# EAGLE design Dashboard rev6 (EAGLE 9.6.2)

## Sheet 1 of 5: Connectors, Power Fusing
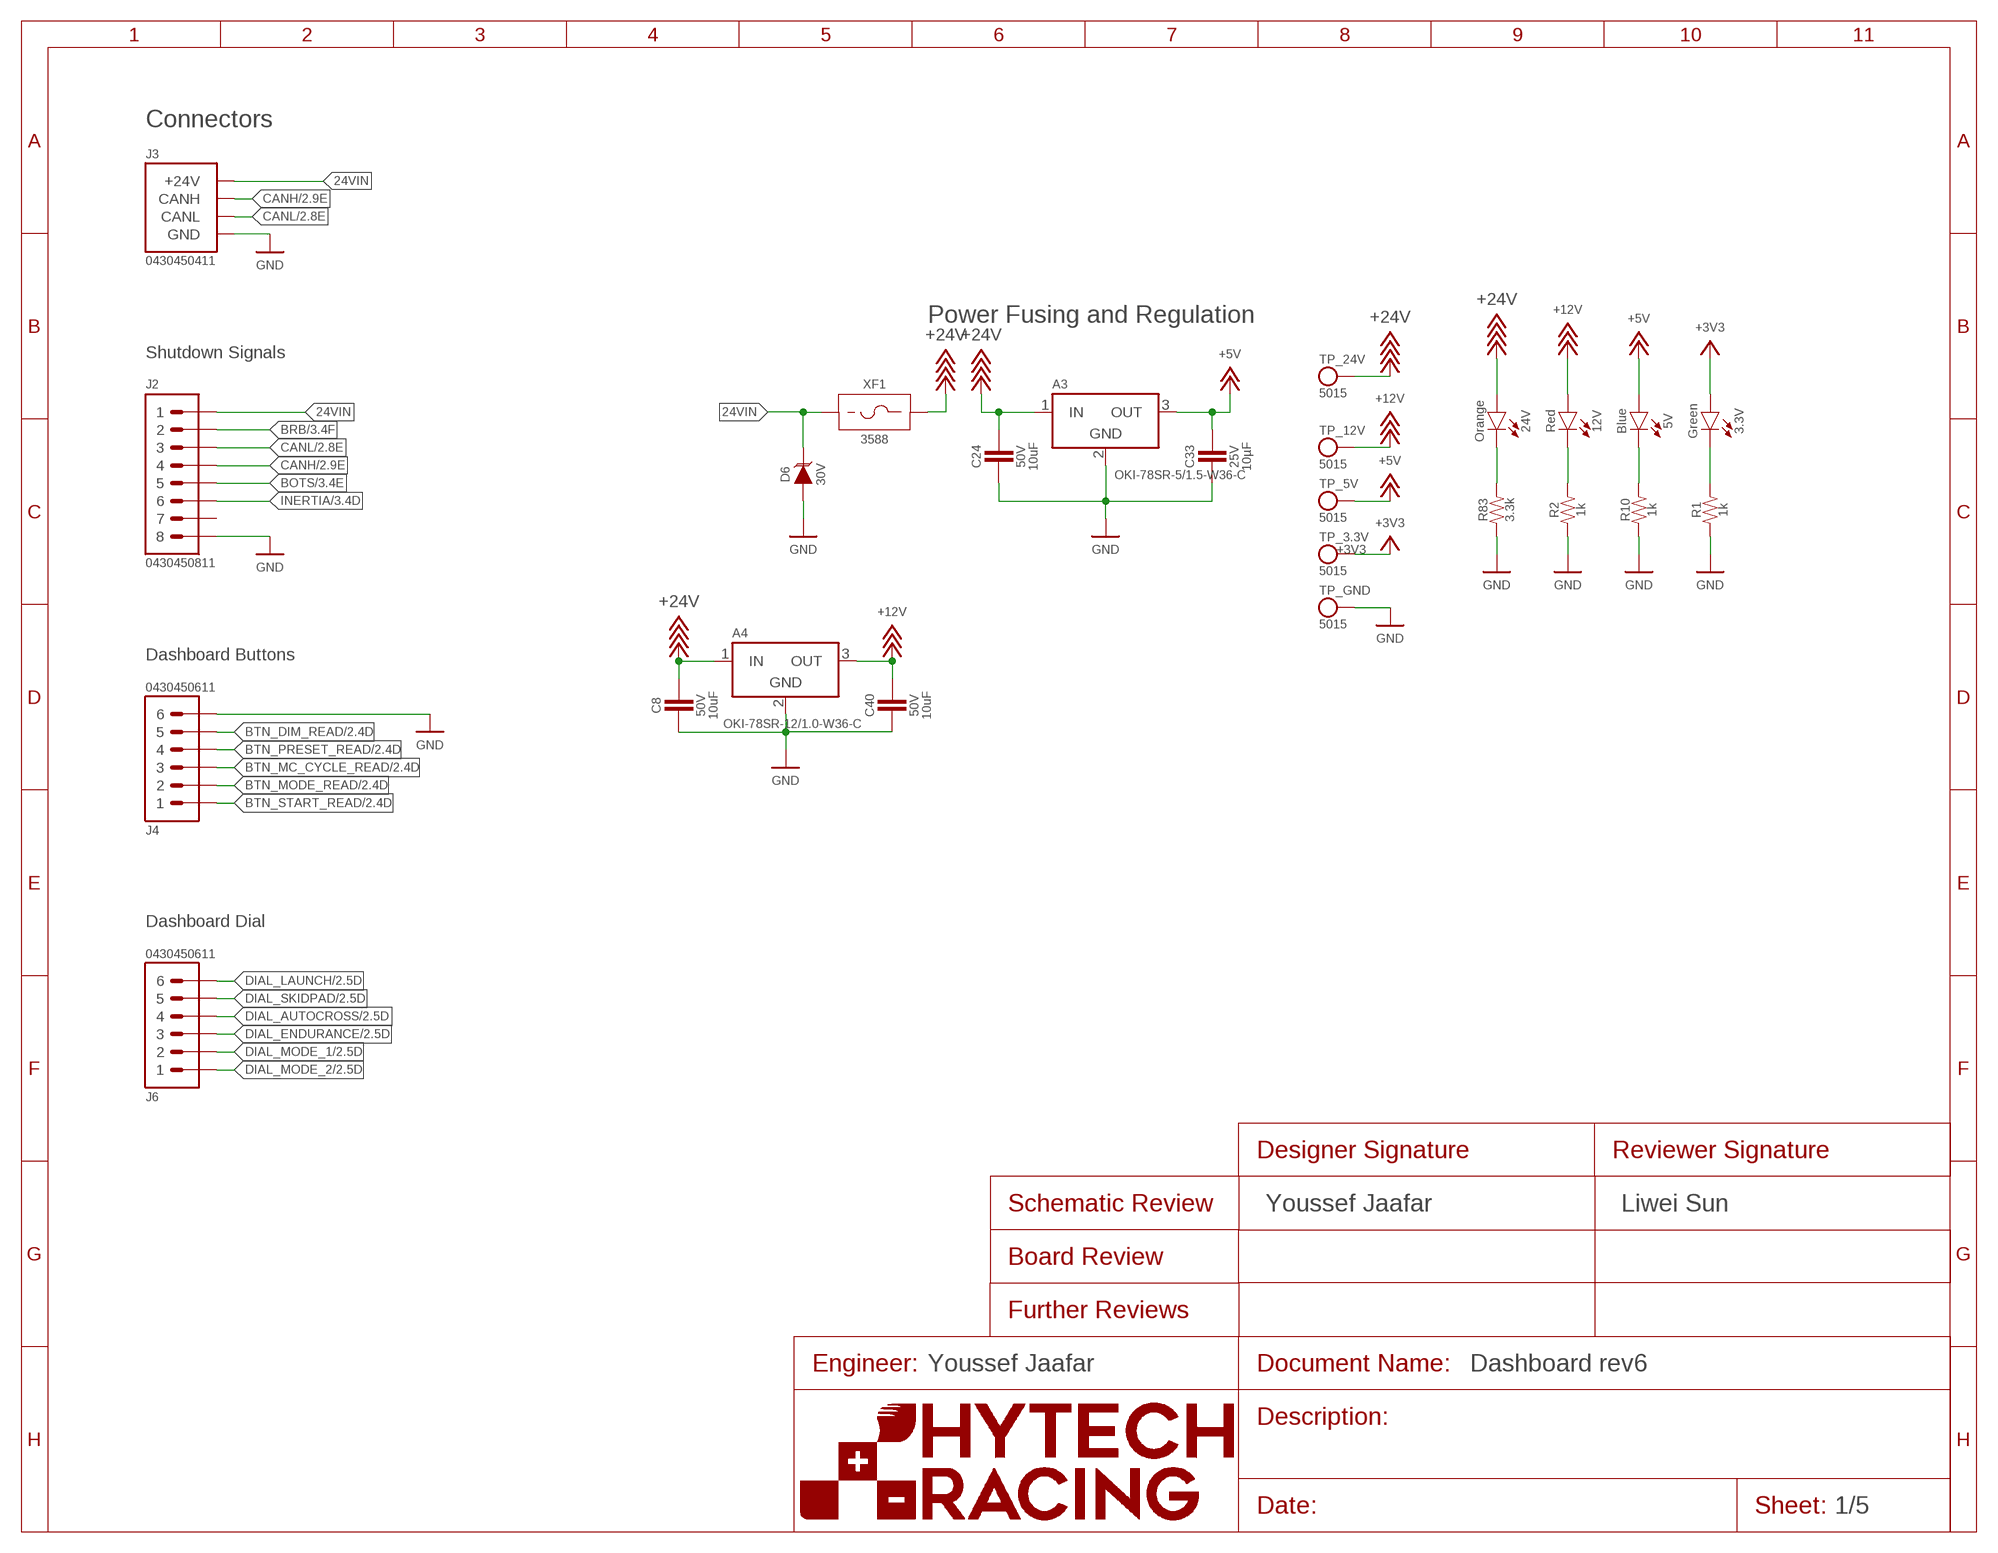
[diagram p0: schematic, sheet 1]

### Parts
3.3V  LED_0603_GREEN  [0603-LED]
5V  LED_0603_BLUE  [0603-LED]
12V  LED_0603_RED  [0603-LED]
24V  LED_0603_ORANGE  [0603-LED]
A3  VOLTAGE_REGULATOR_MODULE_OKI-78SR_5V  [OKI-78SR]
A4  VOLTAGE_REGULATOR_MODULE_OKI-78SR_12V  [OKI-78SR]
C8  CAPACITOR_0805_50V_10UF  [0805-CAP]
C24  CAPACITOR_0805_50V_10UF  [0805-CAP]
C33  CAPACITOR_0603_25V_10UF  [0603-CAP]
C40  CAPACITOR_0805_50V_10UF  [0805-CAP]
D6  TVS_DO-214AA_30V  [DO-214AA]
J2  CONNECTOR-8_μF_S_RA_  [MOLEX_MICROFIT_SMD_RIGHTANGLE_08_DUAL]
J3  CONNECTOR-CAN_μF_S_RA_  [MOLEX_MICROFIT_SMD_RIGHTANGLE_04_DUAL]
J4  CONNECTOR-6_μF_S_RA_  [MOLEX_MICROFIT_SMD_RIGHTANGLE_06_DUAL]
J6  CONNECTOR-6_μF_S_RA_  [MOLEX_MICROFIT_SMD_RIGHTANGLE_06_DUAL]
R1  RESISTOR_0603_1K  [0603-RES]
R2  RESISTOR_0603_1K  [0603-RES]
R10  RESISTOR_0603_1K  [0603-RES]
R83  RESISTOR_0603_3.3K  [0603-RES]
TP_3.3V  TEST_POINT  [5015]
TP_5V  TEST_POINT  [5015]
TP_12V  TEST_POINT  [5015]
TP_24V  TEST_POINT  [5015]
TP_GND  TEST_POINT  [5015]
XF1  FUSE_HOLDER_MINIBLADESMD  [3588]

### Nets
24VIN: D6.2(C) J2.1 J3.1(+24V) XF1.1 XF1.2
+3V3: 3.3V.2(A) TP_3.3V.1 ; also sheet 2
+5V: 5V.2(A) A3.3(OUT) C33.1 TP_5V.1 ; also sheet 2,4
+12V: 12V.2(A) A4.3(OUT) C40.1 TP_12V.1 ; also sheet 3
+24V: 24V.2(A) A3.1(IN) A4.1(IN) C8.1 C24.1 TP_24V.1 XF1.3 XF1.4
BOTS: J2.5 ; also sheet 3
BRB: J2.2 ; also sheet 3
BTN_DIM_READ: J4.5 ; also sheet 2
BTN_MC_CYCLE_READ: J4.3 ; also sheet 2
BTN_MODE_READ: J4.2 ; also sheet 2
BTN_PRESET_READ: J4.4 ; also sheet 2
BTN_START_READ: J4.1 ; also sheet 2
CANH: J2.4 J3.4(CANH) ; also sheet 2
CANL: J2.3 J3.3(CANL) ; also sheet 2
DIAL_AUTOCROSS: J6.4 ; also sheet 2
DIAL_ENDURANCE: J6.3 ; also sheet 2
DIAL_LAUNCH: J6.6 ; also sheet 2
DIAL_MODE_1: J6.2 ; also sheet 2
DIAL_MODE_2: J6.1 ; also sheet 2
DIAL_SKIDPAD: J6.5 ; also sheet 2
GND: A3.2(GND) A4.2(GND) C8.2 C24.2 C33.2 C40.2 D6.1(A) J2.8 J3.2(GND) J4.6 R1.1 R2.1 R10.1 R83.1 TP_GND.1 ; also sheet 2,3,4
INERTIA: J2.6 ; also sheet 3
N$31: 3.3V.1(C) R1.2
N$32: 5V.1(C) R10.2
N$33: 12V.1(C) R2.2
N$38: 24V.1(C) R83.2
Unconnected: J2.7

### Notes on the sheet
- Connectors
- Power Fusing and Regulation
- Shutdown Signals
- Dashboard Buttons
- Dashboard Dial
- Youssef Jaafar | Liwei Sun
- Youssef Jaafar

## Sheet 2 of 5: Teensy, CAN, IO-Expander, 7-Segment
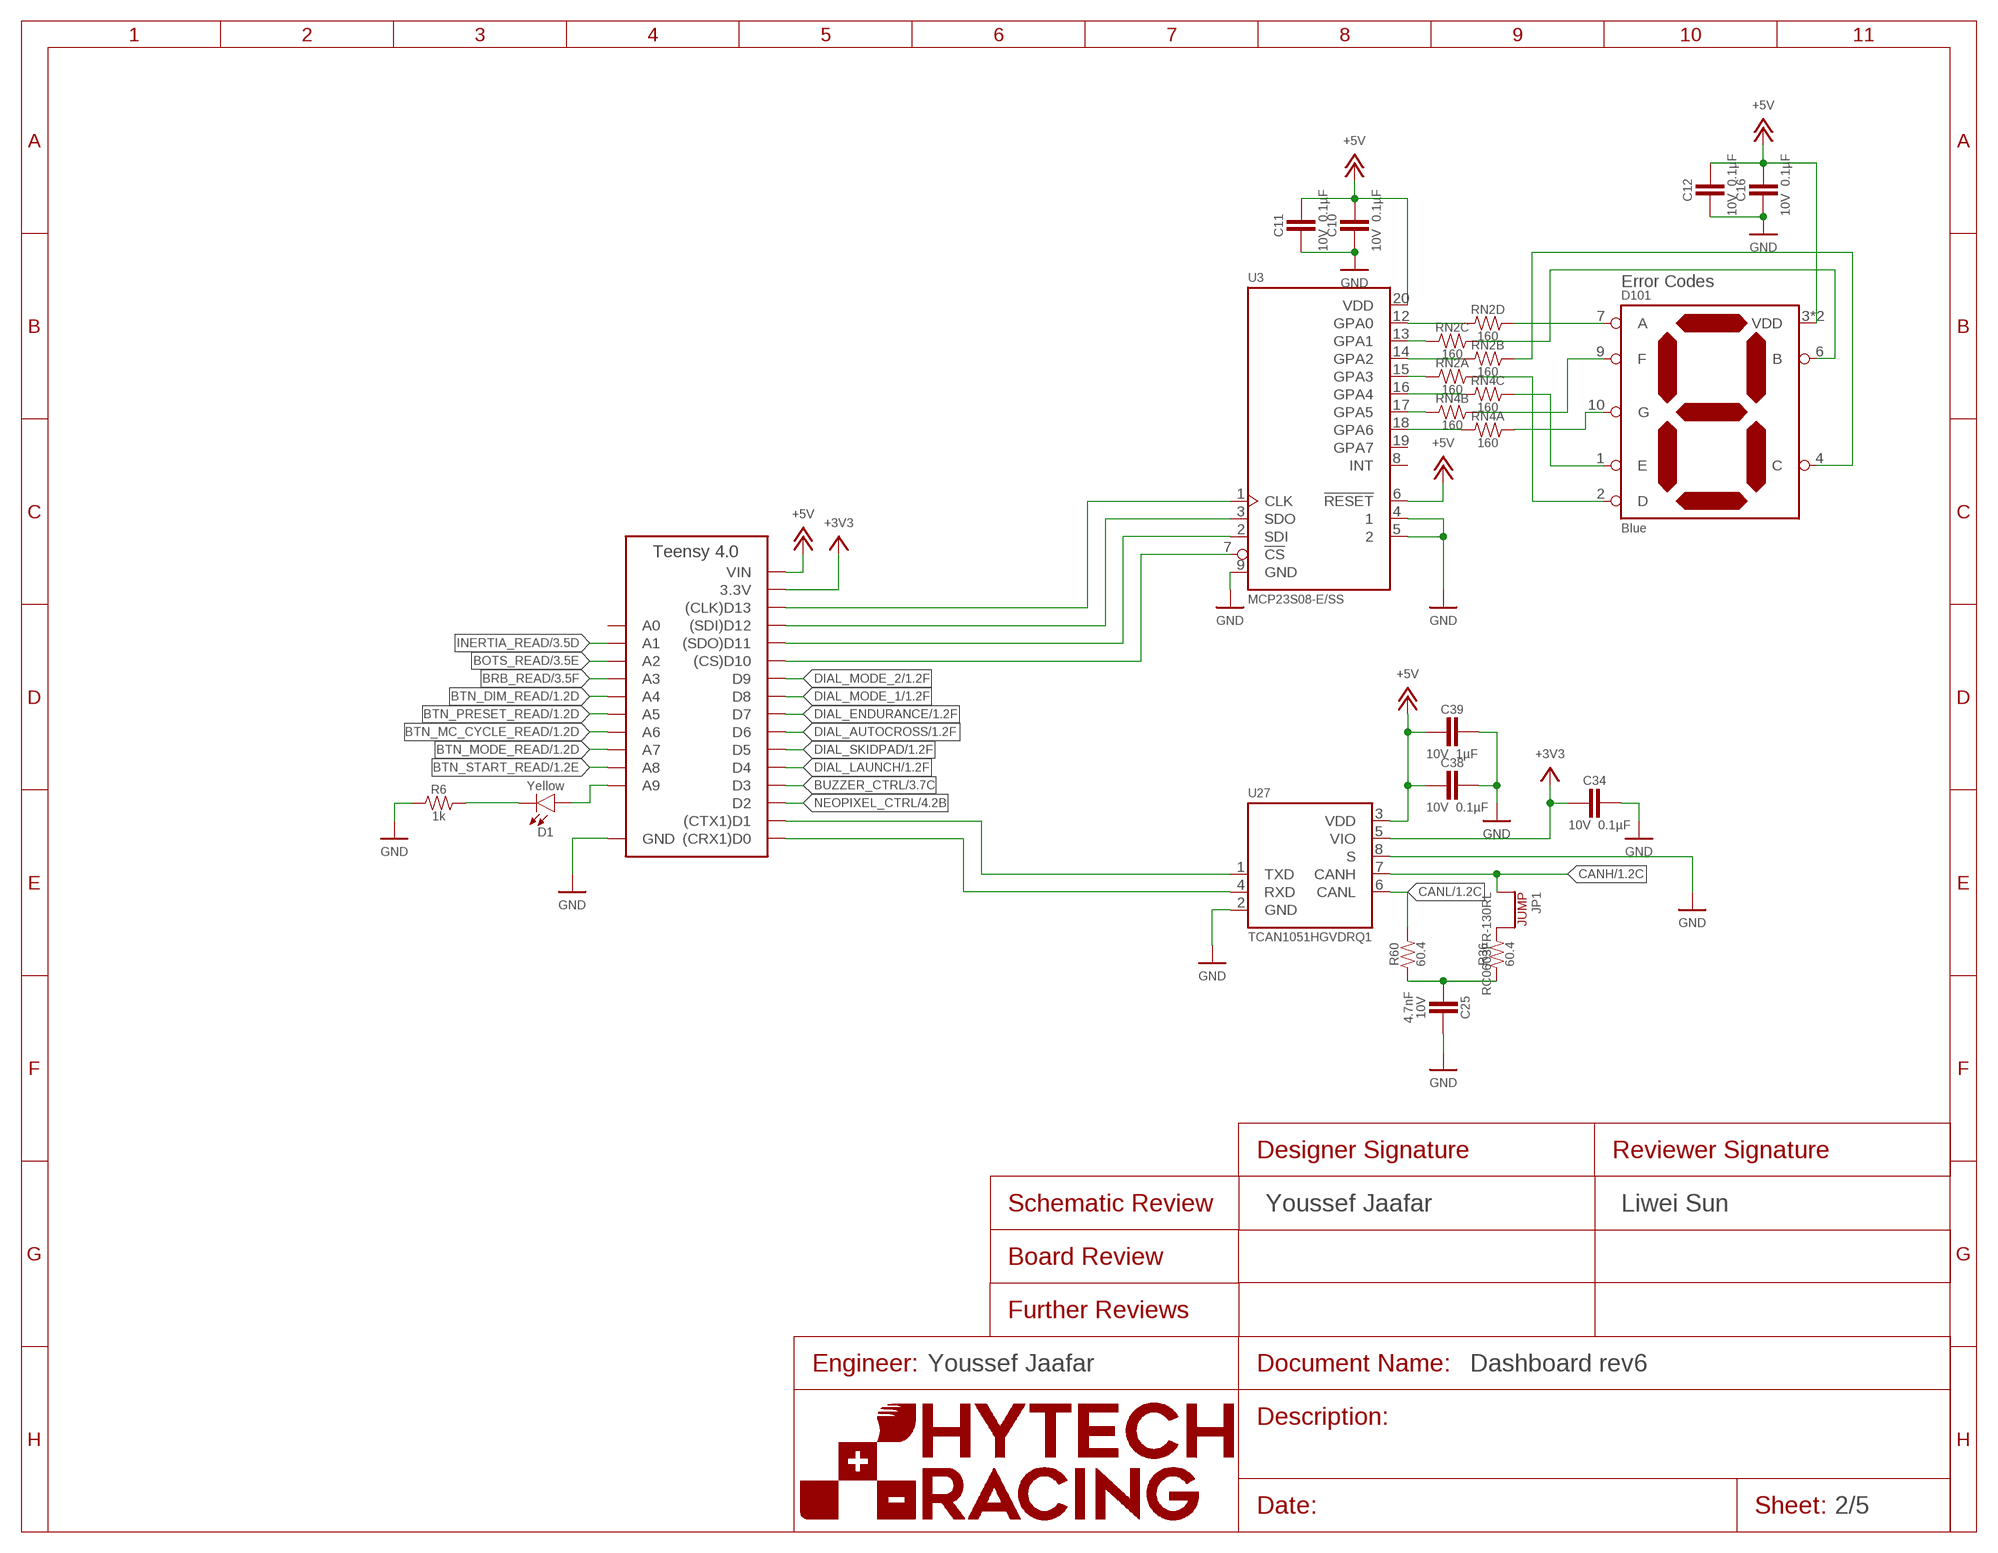
[diagram p1: schematic, sheet 2]

### Parts
A2  TEENSY_4.0SM  [TEENSY_SHORT_SSM]
C10  CAPACITOR_0603_10V_0.1UF  [0603-CAP]
C11  CAPACITOR_0603_10V_0.1UF  [0603-CAP]
C12  CAPACITOR_0603_10V_0.1UF  [0603-CAP]
C16  CAPACITOR_0603_10V_0.1UF  [0603-CAP]
C25  CAPACITOR_0603_10V_4.7NF  [0603-CAP]
C34  CAPACITOR_0603_10V_0.1UF  [0603-CAP]
C38  CAPACITOR_0603_10V_0.1UF  [0603-CAP]
C39  CAPACITOR_0603_10V_1UF  [0603-CAP]
D1  LED_0603_YELLOW  [0603-LED]
D101  LED_7_SEGMENT_BLUE_DSM7TA  [DSM7T]
JP1  JUMPER_0603_  [0603-RES]
R6  RESISTOR_0603_1K  [0603-RES]
R36  RESISTOR_0603_60.4  [0603-RES]
R60  RESISTOR_0603_60.4  [0603-RES]
RN2  RESISTOR_NETWORK_4_160  [1206-RES-ARRAY]
RN4  RESISTOR_NETWORK_4_160  [1206-RES-ARRAY]
U3  MCP23S08  [SSOP-20]
U27  TCAN1051HQV-Q1  [SOIC-08(NARROW,0.15")]

### Nets
+3V3: A2.3.3V C34.2 U27.5(VIO) ; also sheet 1
+5V: A2.VIN C10.1 C11.1 C12.1 C16.1 C38.2 C39.2 D101.3(VDD) D101.8(VDD) U3.6(!RESET) U3.20(VDD) U27.3(VDD) ; also sheet 1,4
A: D101.7(A) RN2.5
A2: RN2.4 U3.12(GPA0)
B: D101.6(B) RN2.6
B2: RN2.3 U3.13(GPA1)
BOTS_READ: A2.D16(A2) ; also sheet 3
BRB_READ: A2.D17(A3) ; also sheet 3
BTN_DIM_READ: A2.D18(A4) ; also sheet 1
BTN_MC_CYCLE_READ: A2.D20(A6) ; also sheet 1
BTN_MODE_READ: A2.D21(A7) ; also sheet 1
BTN_PRESET_READ: A2.D19(A5) ; also sheet 1
BTN_START_READ: A2.D22(A8) ; also sheet 1
BUZZER_CTRL: A2.D3 ; also sheet 3
C: D101.4(C) RN2.7
C2: RN2.2 U3.14(GPA2)
CANH: JP1.1 U27.7(CANH) ; also sheet 1
CANL: R60.2 U27.6(CANL) ; also sheet 1
CIPO: A2.D12((SDI)D12) U3.3(SDO)
CLK: A2.D13((CLK)D13) U3.1(CLK)
COPI: A2.D11((SDO)D11) U3.2(SDI)
CRX: A2.D0((CRX1)D0) U27.4(RXD)
CS_CAN: A2.D10((CS)D10) U3.7(!CS)
CTX: A2.D1((CTX1)D1) U27.1(TXD)
D: D101.2(D) RN2.8
D2: RN2.1 U3.15(GPA3)
DIAL_AUTOCROSS: A2.D6 ; also sheet 1
DIAL_ENDURANCE: A2.D7 ; also sheet 1
DIAL_LAUNCH: A2.D4 ; also sheet 1
DIAL_MODE_1: A2.D8 ; also sheet 1
DIAL_MODE_2: A2.D9 ; also sheet 1
DIAL_SKIDPAD: A2.D5 ; also sheet 1
E: D101.1(E) RN4.6
E2: RN4.3 U3.16(GPA4)
F: D101.9(F) RN4.7
F2: RN4.2 U3.17(GPA5)
G: D101.10(G) RN4.8
G2: RN4.1 U3.18(GPA6)
GND: A2.AGND/GND(GND) A2.GND C10.2 C11.2 C12.2 C16.2 C25.1 C34.1 C38.1 C39.1 R6.1 U3.4 U3.5 U3.9(GND) U27.2(GND) U27.8(S) ; also sheet 1,3,4
INERTIA_READ: A2.D15(A1) ; also sheet 3
N$3: D1.1(C) R6.2
N$10: JP1.2 R36.2
N$21: C25.2 R36.1 R60.1
NEOPIXEL_CTRL: A2.D2 ; also sheet 4
TEENSY_ON: A2.D23(A9) D1.2(A)
Unconnected: A2.D14(A0) RN4.4 RN4.5 U3.8(INT) U3.19(GPA7)

### Notes on the sheet
- Error Codes
- Youssef Jaafar | Liwei Sun
- Youssef Jaafar

## Sheet 3 of 5: Shutdown Read, Buzzer Control
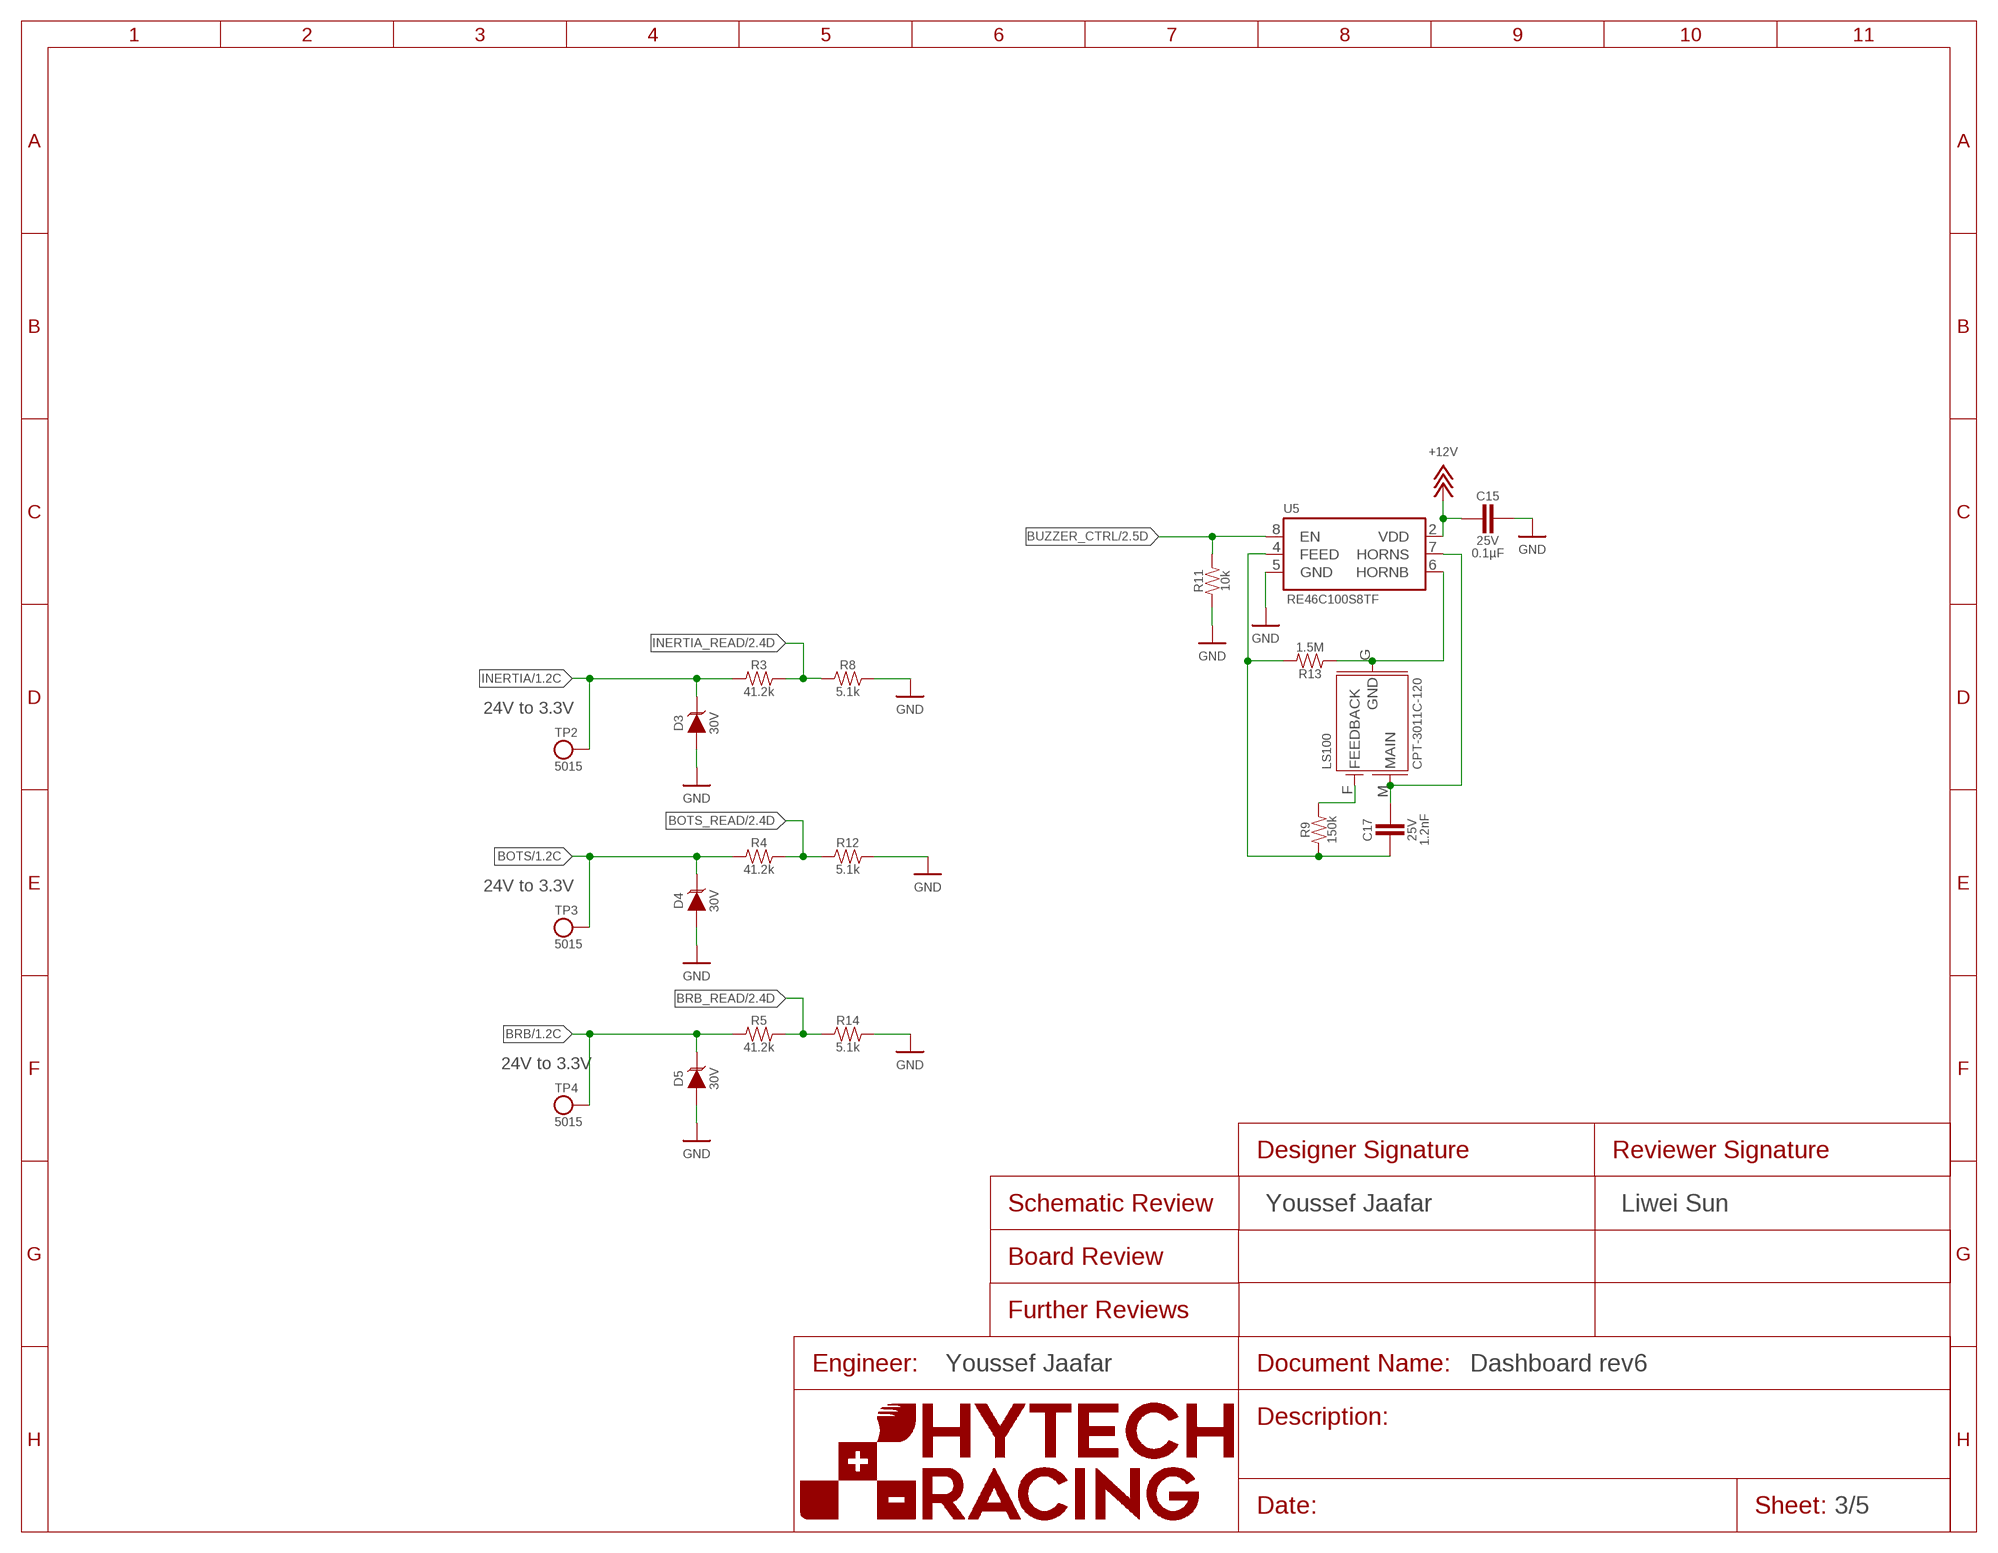
[diagram p2: schematic, sheet 3]

### Parts
C15  CAPACITOR_0603_25V_0.1UF  [0603-CAP]
C17  CAPACITOR_0603_25V_1.2NF  [0603-CAP]
D3  TVS_DO-214AA_30V  [DO-214AA]
D4  TVS_DO-214AA_30V  [DO-214AA]
D5  TVS_DO-214AA_30V  [DO-214AA]
LS100  BUZZER_3_PIN_CPT-3011C-120  [CPT-3011C-120]
R3  RESISTOR_0603_41.2K  [0603-RES]
R4  RESISTOR_0603_41.2K  [0603-RES]
R5  RESISTOR_0603_41.2K  [0603-RES]
R8  RESISTOR_0603_5.1K  [0603-RES]
R9  RESISTOR_0603_150K  [0603-RES]
R11  RESISTOR_0603_10K  [0603-RES]
R12  RESISTOR_0603_5.1K  [0603-RES]
R13  RESISTOR_0603_1.5M  [0603-RES]
R14  RESISTOR_0603_5.1K  [0603-RES]
TP2  TEST_POINT  [5015]
TP3  TEST_POINT  [5015]
TP4  TEST_POINT  [5015]
U5  RE46C100  [SOIC-08(NARROW,0.15")]

### Nets
+12V: C15.2 U5.2(VDD) ; also sheet 1
BOTS: D4.2(C) R4.1 TP3.1 ; also sheet 1
BOTS_READ: R4.2 R12.1 ; also sheet 2
BRB: D5.2(C) R5.1 TP4.1 ; also sheet 1
BRB_READ: R5.2 R14.1 ; also sheet 2
BUZZER_CTRL: R11.2 U5.8(EN) ; also sheet 2
FEED: C17.2 R9.1 R13.2 U5.4(FEED)
GND: C15.1 D3.1(A) D4.1(A) D5.1(A) R8.2 R11.1 R12.2 R14.2 U5.5(GND) ; also sheet 1,2,4
HORNB: LS100.G(GND) R13.1 U5.6(HORNB)
HORNS: C17.1 LS100.M(MAIN) U5.7(HORNS)
INERTIA: D3.2(C) R3.1 TP2.1 ; also sheet 1
INERTIA_READ: R3.2 R8.1 ; also sheet 2
N$54: LS100.F(FEEDBACK) R9.2

### Notes on the sheet
- 24V to 3.3V
- 24V to 3.3V
- 24V to 3.3V
- Youssef Jaafar | Liwei Sun
- Youssef Jaafar

## Sheet 4 of 5: Neopixels
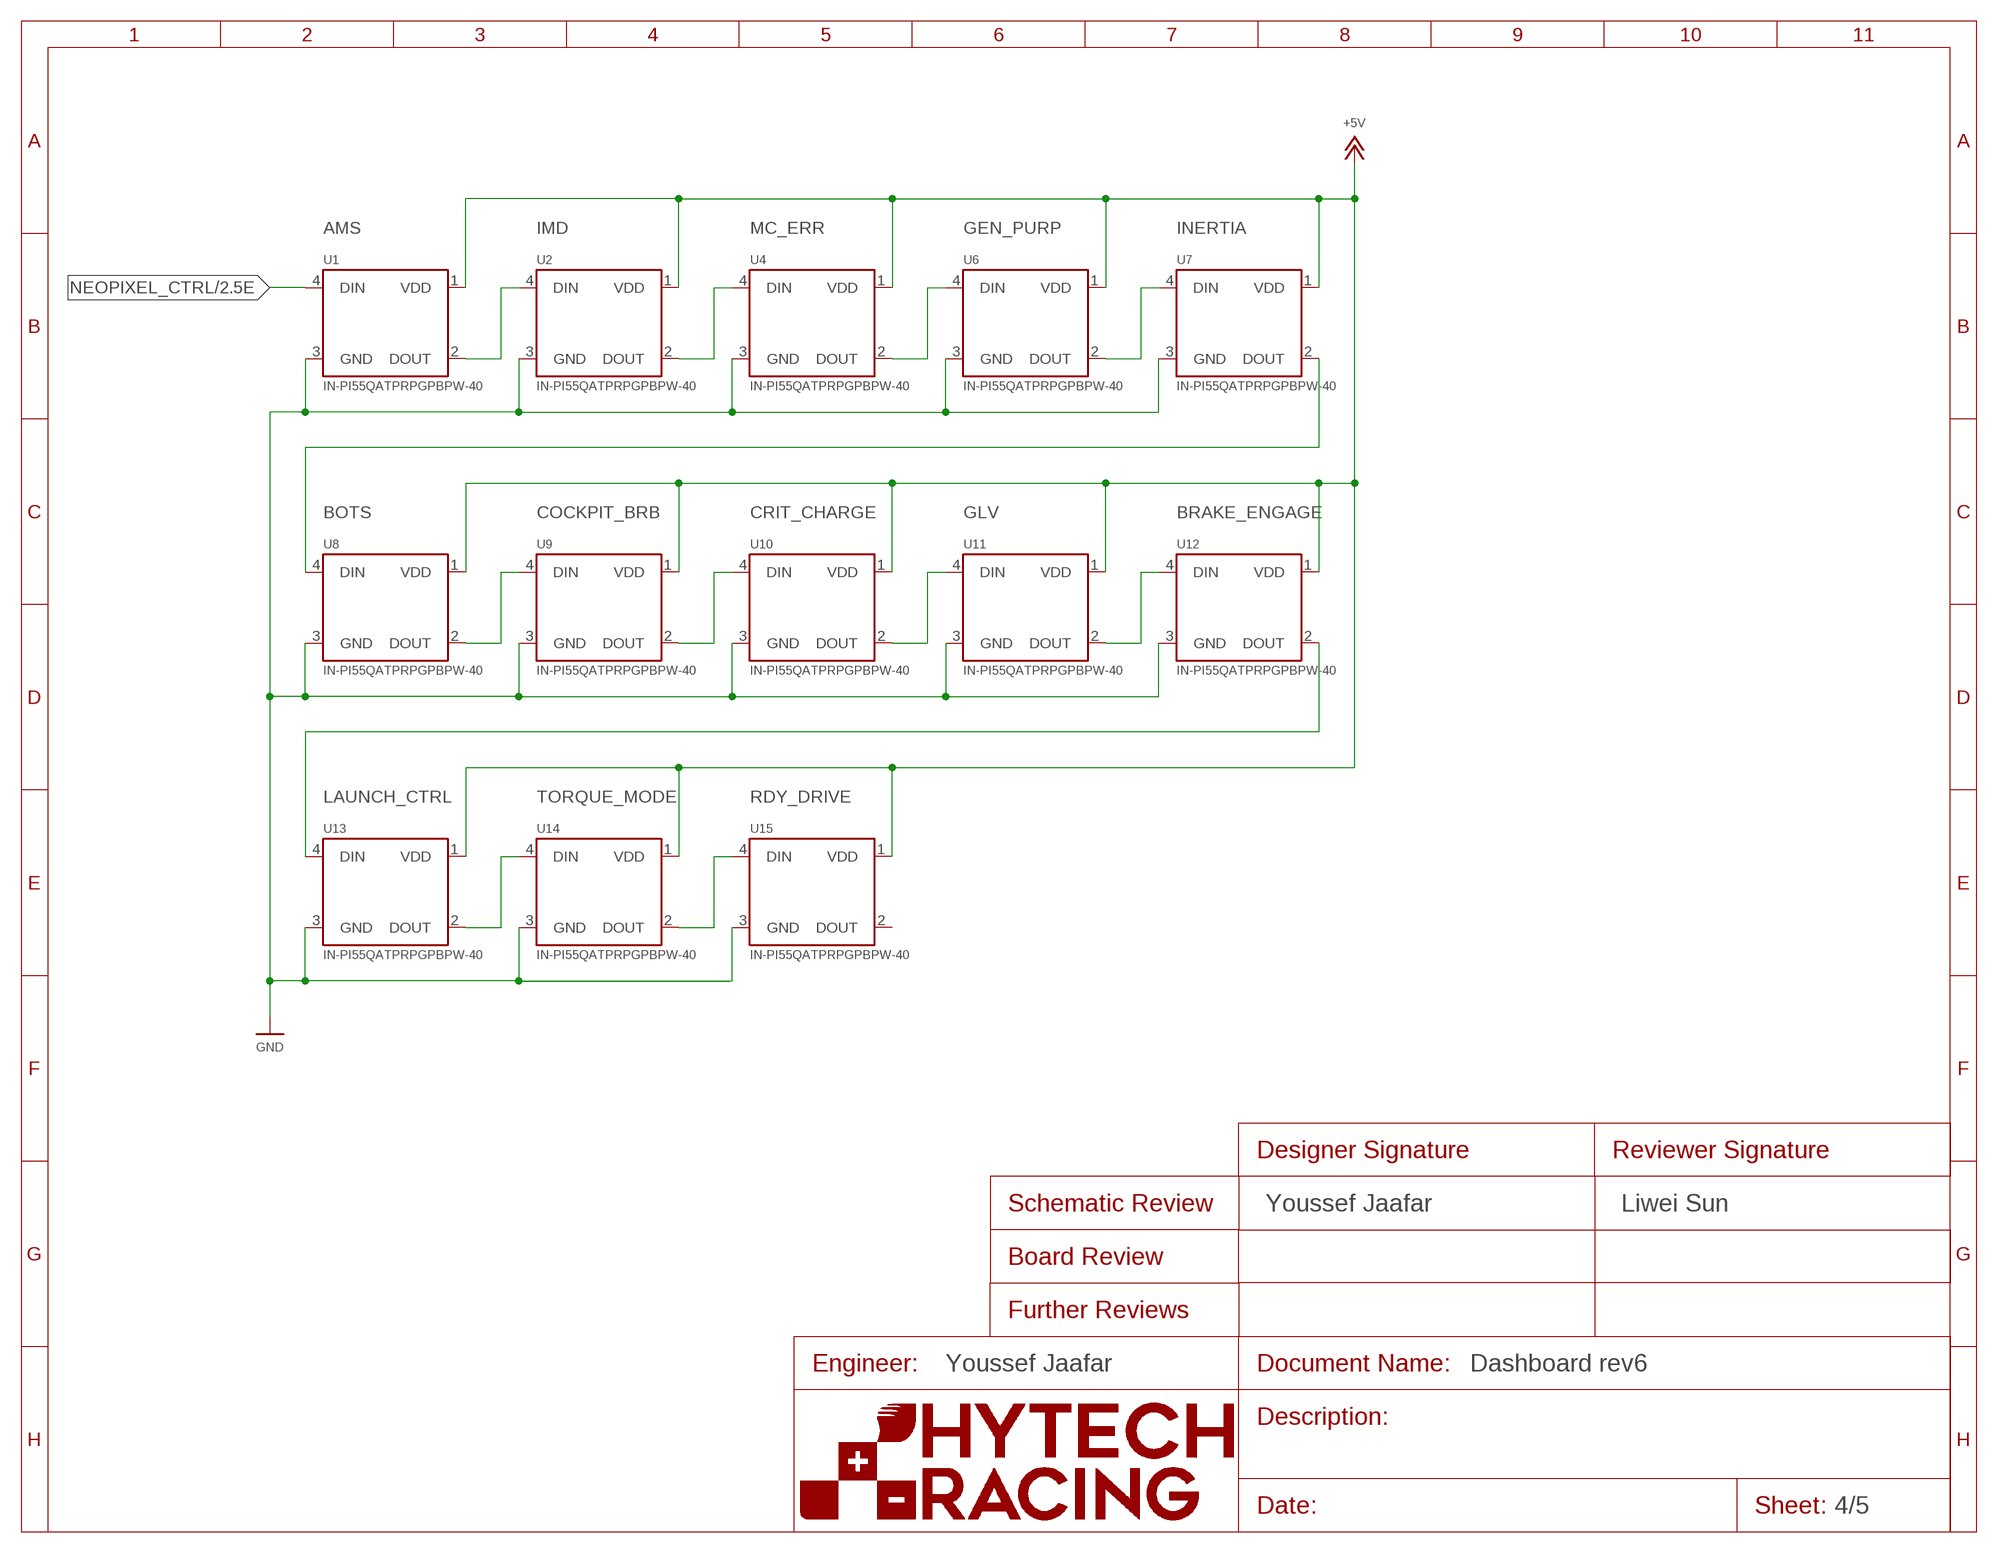
[diagram p3: schematic, sheet 4]

### Parts
U1  NEOPIXEL_IN-PI55QATPRPGPBPW-40  [NEOPIXEL]
U2  NEOPIXEL_IN-PI55QATPRPGPBPW-40  [NEOPIXEL]
U4  NEOPIXEL_IN-PI55QATPRPGPBPW-40  [NEOPIXEL]
U6  NEOPIXEL_IN-PI55QATPRPGPBPW-40  [NEOPIXEL]
U7  NEOPIXEL_IN-PI55QATPRPGPBPW-40  [NEOPIXEL]
U8  NEOPIXEL_IN-PI55QATPRPGPBPW-40  [NEOPIXEL]
U9  NEOPIXEL_IN-PI55QATPRPGPBPW-40  [NEOPIXEL]
U10  NEOPIXEL_IN-PI55QATPRPGPBPW-40  [NEOPIXEL]
U11  NEOPIXEL_IN-PI55QATPRPGPBPW-40  [NEOPIXEL]
U12  NEOPIXEL_IN-PI55QATPRPGPBPW-40  [NEOPIXEL]
U13  NEOPIXEL_IN-PI55QATPRPGPBPW-40  [NEOPIXEL]
U14  NEOPIXEL_IN-PI55QATPRPGPBPW-40  [NEOPIXEL]
U15  NEOPIXEL_IN-PI55QATPRPGPBPW-40  [NEOPIXEL]

### Nets
+5V: U1.1(VDD) U2.1(VDD) U4.1(VDD) U6.1(VDD) U7.1(VDD) U8.1(VDD) U9.1(VDD) U10.1(VDD) U11.1(VDD) U12.1(VDD) U13.1(VDD) U14.1(VDD) U15.1(VDD) ; also sheet 1,2
GND: U1.3(GND) U2.3(GND) U4.3(GND) U6.3(GND) U7.3(GND) U8.3(GND) U9.3(GND) U10.3(GND) U11.3(GND) U12.3(GND) U13.3(GND) U14.3(GND) U15.3(GND) ; also sheet 1,2,3
N$1: U10.2(DOUT) U11.4(DIN)
N$4: U8.2(DOUT) U9.4(DIN)
N$5: U1.2(DOUT) U2.4(DIN)
N$6: U2.2(DOUT) U4.4(DIN)
N$7: U4.2(DOUT) U6.4(DIN)
N$8: U6.2(DOUT) U7.4(DIN)
N$9: U11.2(DOUT) U12.4(DIN)
N$12: U14.2(DOUT) U15.4(DIN)
N$20: U13.2(DOUT) U14.4(DIN)
N$23: U9.2(DOUT) U10.4(DIN)
N$26: U7.2(DOUT) U8.4(DIN)
N$27: U12.2(DOUT) U13.4(DIN)
NEOPIXEL_CTRL: U1.4(DIN) ; also sheet 2
Unconnected: U15.2(DOUT)

### Notes on the sheet
- AMS | IMD | MC_ERR | GEN_PURP | INERTIA
- BOTS | COCKPIT_BRB | CRIT_CHARGE | GLV | BRAKE_ENGAGE
- LAUNCH_CTRL | TORQUE_MODE | RDY_DRIVE
- Youssef Jaafar | Liwei Sun
- Youssef Jaafar

## Sheet 5 of 5: Ordering Components
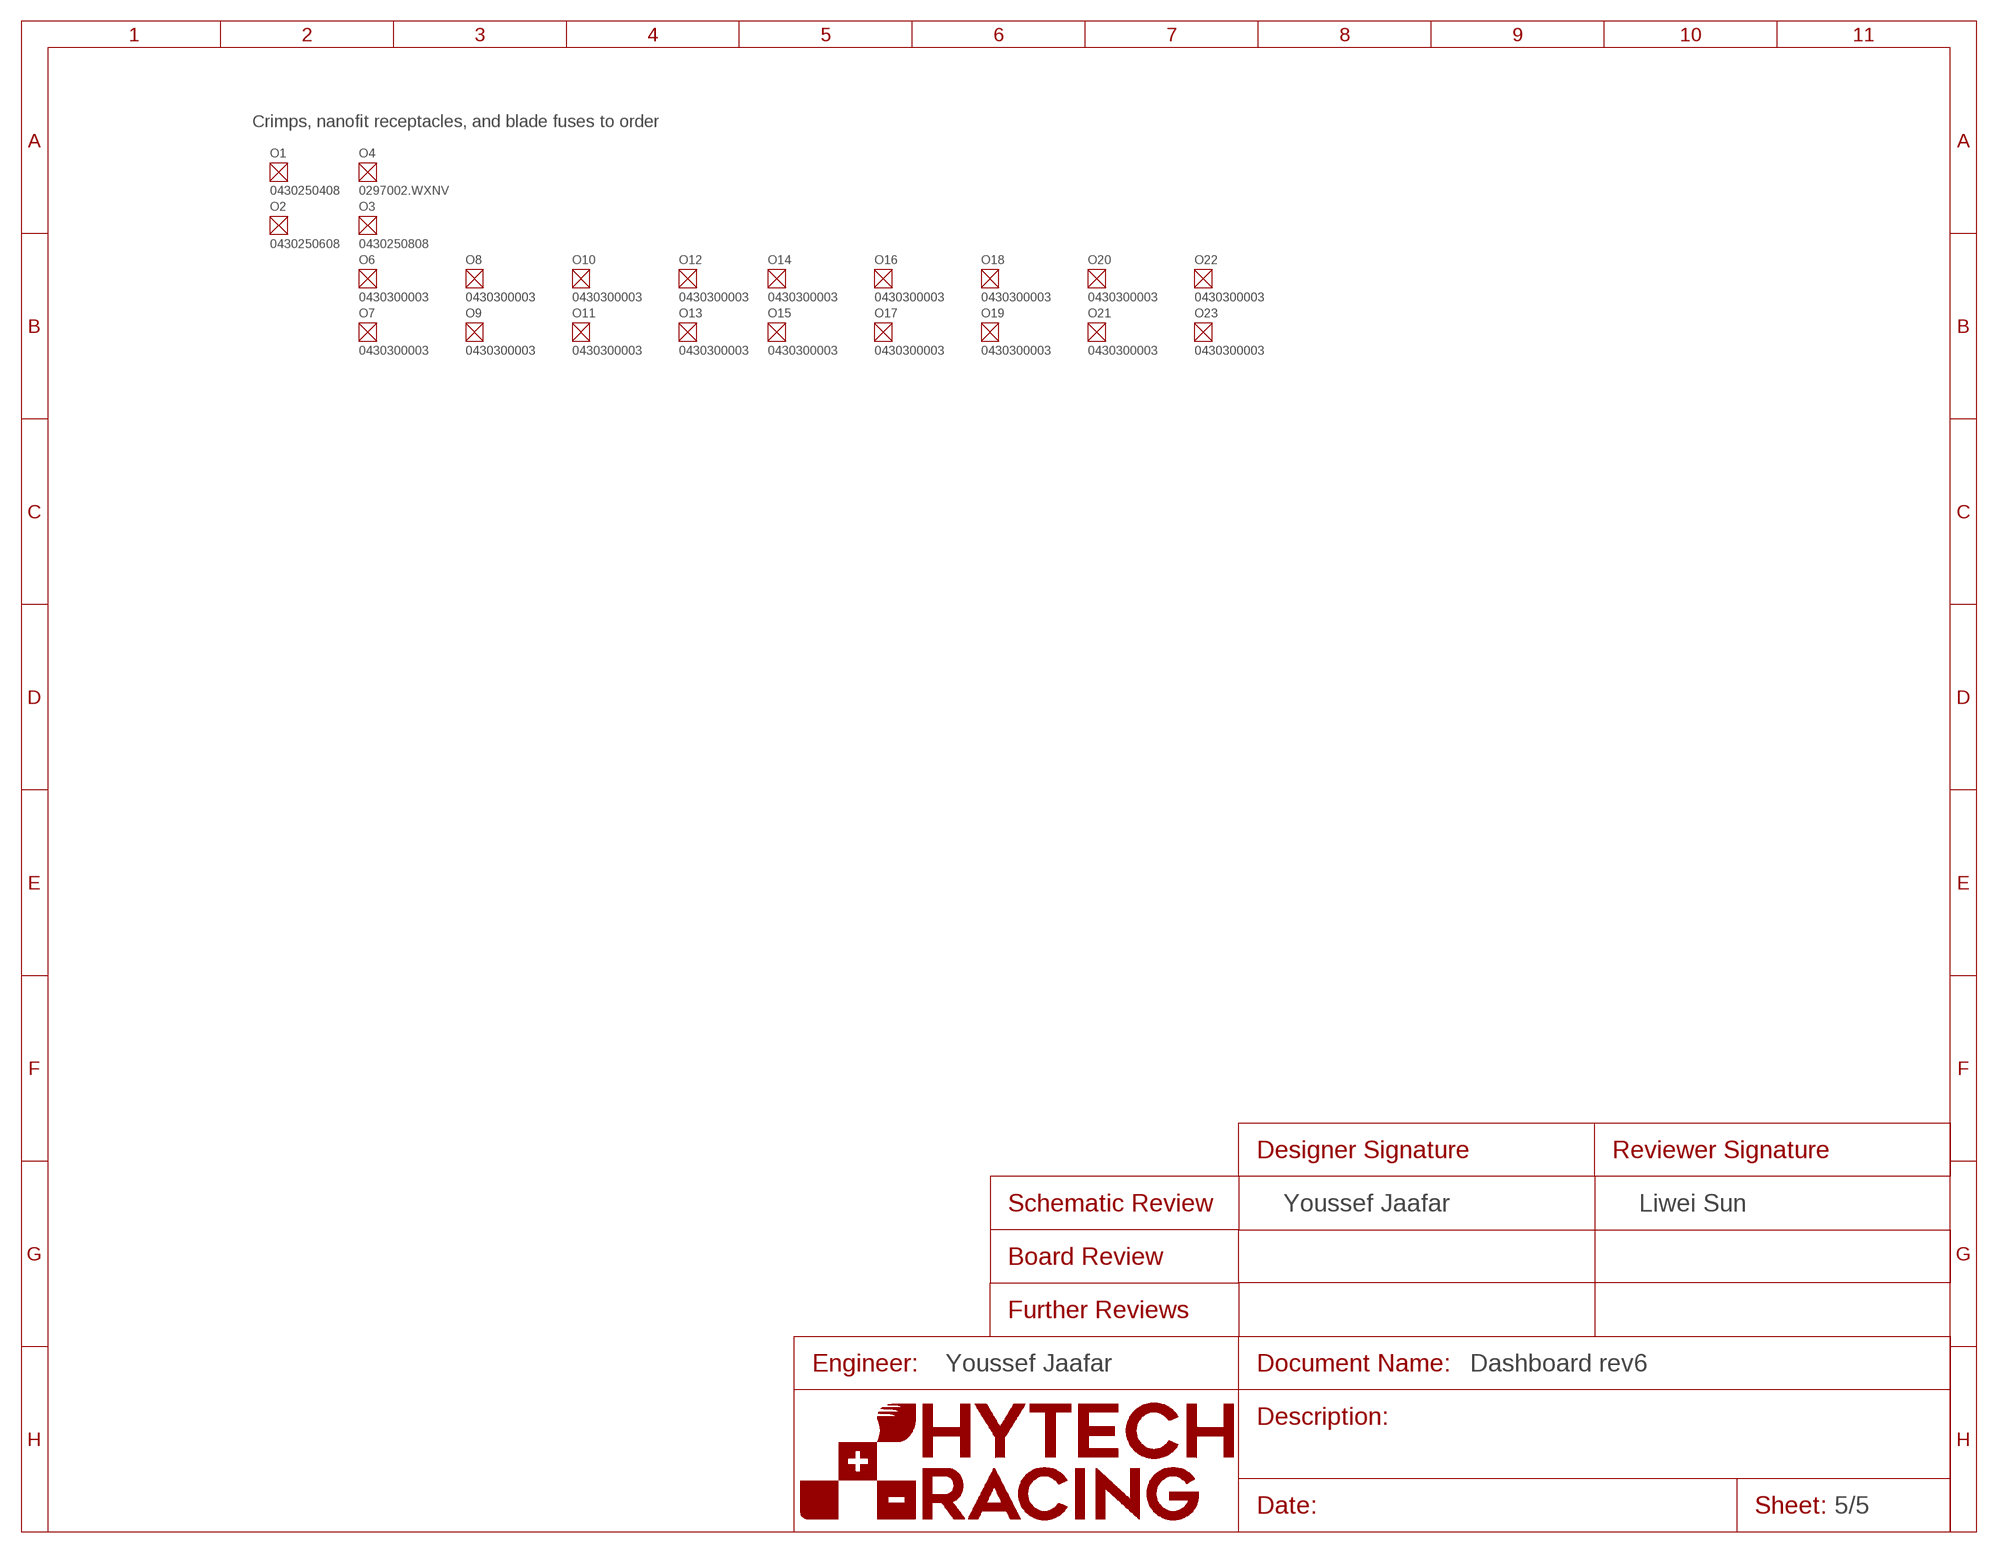
[diagram p4: schematic, sheet 5]
O1 (RECEPTACLE-4_MICROFIT): DKPN: WM11225-ND; MANUFACTURER: Molex; MOPN: 538-43025-0408; MPN: 0430250408
O2 (RECEPTACLE-6_MICROFIT): DKPN: WM13209-ND; MANUFACTURER: Molex; MOPN: 538-43025-0608; MPN: 0430250608
O3 (RECEPTACLE-8_MICROFIT): DKPN: WM13210-ND; MANUFACTURER: Molex; MOPN: 538-43025-0808; MPN: 0430250808
O4 (FUSE_MINI_BLADE_2): CURRENT: 2A; DKPN: F986-ND; FUSE_TYPE: MINI 297; MANUFACTURER: Littelfuse Inc.; MOPN: 576-0297002.WXNV; MPN: 0297002.WXNV
O6 (CRIMP_MICROFIT_20-24): DKPN: WM2776CT-ND; GAUGE: 20-24; MANUFACTURER: Molex; MOPN: 538-43030-0003; MPN: 0430300003
O7 (CRIMP_MICROFIT_20-24): DKPN: WM2776CT-ND; GAUGE: 20-24; MANUFACTURER: Molex; MOPN: 538-43030-0003; MPN: 0430300003
O8 (CRIMP_MICROFIT_20-24): DKPN: WM2776CT-ND; GAUGE: 20-24; MANUFACTURER: Molex; MOPN: 538-43030-0003; MPN: 0430300003
O9 (CRIMP_MICROFIT_20-24): DKPN: WM2776CT-ND; GAUGE: 20-24; MANUFACTURER: Molex; MOPN: 538-43030-0003; MPN: 0430300003
O10 (CRIMP_MICROFIT_20-24): DKPN: WM2776CT-ND; GAUGE: 20-24; MANUFACTURER: Molex; MOPN: 538-43030-0003; MPN: 0430300003
O11 (CRIMP_MICROFIT_20-24): DKPN: WM2776CT-ND; GAUGE: 20-24; MANUFACTURER: Molex; MOPN: 538-43030-0003; MPN: 0430300003
O12 (CRIMP_MICROFIT_20-24): DKPN: WM2776CT-ND; GAUGE: 20-24; MANUFACTURER: Molex; MOPN: 538-43030-0003; MPN: 0430300003
O13 (CRIMP_MICROFIT_20-24): DKPN: WM2776CT-ND; GAUGE: 20-24; MANUFACTURER: Molex; MOPN: 538-43030-0003; MPN: 0430300003
O14 (CRIMP_MICROFIT_20-24): DKPN: WM2776CT-ND; GAUGE: 20-24; MANUFACTURER: Molex; MOPN: 538-43030-0003; MPN: 0430300003
O15 (CRIMP_MICROFIT_20-24): DKPN: WM2776CT-ND; GAUGE: 20-24; MANUFACTURER: Molex; MOPN: 538-43030-0003; MPN: 0430300003
O16 (CRIMP_MICROFIT_20-24): DKPN: WM2776CT-ND; GAUGE: 20-24; MANUFACTURER: Molex; MOPN: 538-43030-0003; MPN: 0430300003
O17 (CRIMP_MICROFIT_20-24): DKPN: WM2776CT-ND; GAUGE: 20-24; MANUFACTURER: Molex; MOPN: 538-43030-0003; MPN: 0430300003
O18 (CRIMP_MICROFIT_20-24): DKPN: WM2776CT-ND; GAUGE: 20-24; MANUFACTURER: Molex; MOPN: 538-43030-0003; MPN: 0430300003
O19 (CRIMP_MICROFIT_20-24): DKPN: WM2776CT-ND; GAUGE: 20-24; MANUFACTURER: Molex; MOPN: 538-43030-0003; MPN: 0430300003
O20 (CRIMP_MICROFIT_20-24): DKPN: WM2776CT-ND; GAUGE: 20-24; MANUFACTURER: Molex; MOPN: 538-43030-0003; MPN: 0430300003
O21 (CRIMP_MICROFIT_20-24): DKPN: WM2776CT-ND; GAUGE: 20-24; MANUFACTURER: Molex; MOPN: 538-43030-0003; MPN: 0430300003
O22 (CRIMP_MICROFIT_20-24): DKPN: WM2776CT-ND; GAUGE: 20-24; MANUFACTURER: Molex; MOPN: 538-43030-0003; MPN: 0430300003
O23 (CRIMP_MICROFIT_20-24): DKPN: WM2776CT-ND; GAUGE: 20-24; MANUFACTURER: Molex; MOPN: 538-43030-0003; MPN: 0430300003

### Notes on the sheet
- Crimps, nanofit receptacles, and blade fuses to order
- Youssef Jaafar | Liwei Sun
- Youssef Jaafar

## Library data of the parts
3.3V = HyTechDevices - Copy:LED_?_*: LED; COLOR: Green; DKPN: 754-1790-1-ND; MANUFACTURER: Kingbright; MOPN: 604-APT1608ZGCK; MPN: APT1608ZGCK
5V = HyTechDevices - Copy:LED_?_*: LED; COLOR: Blue; DKPN: 754-1789-1-ND; MANUFACTURER: Kingbright; MOPN: 604-APT1608VBC/D; MPN: APT1608VBC/D
12V = HyTechDevices - Copy:LED_?_*: LED; COLOR: Red; DKPN: 754-1786-1-ND; MANUFACTURER: Kingbright; MOPN: 604-APT1608SECKJ3PRV; MPN: APT1608SECK/J3-PRV
24V = HyTechDevices:LED_?_*: LED; COLOR: Orange; DKPN: 754-1120-1-ND; MANUFACTURER: Kingbright; MOPN: 604-APT1608SECK; MPN: APT1608SECK
A2 = HyTechDevices:TEENSY_4.0: Teensy 4.0 Datasheet <https://www.pjrc.com/store/teensy40.html> Requires ordering of: 2: 14 pin, 0.1" pitch female headers. Recommend Samtec SSM-114-L-SV for surface mount variant.; TEENSY: 4.0
A3 = HyTechDevices:VOLTAGE_REGULATOR_MODULE_?_*: Voltage Regulator Modules OKI-78SR Datasheet <https://www.mouser.com/datasheet/2/281/oki-78sr-56393.pdf>; DKPN: 811-2196-5-ND; MANUFACTURER: Murata Power Solutions Inc.; MOPN: 580-OKI78SR5/1.5W36C; MPN: OKI-78SR-5/1.5-W36-C
A4 = HyTechDevices:VOLTAGE_REGULATOR_MODULE_?_*: Voltage Regulator Modules OKI-78SR Datasheet <https://www.mouser.com/datasheet/2/281/oki-78sr-56393.pdf>; DKPN: 811-3293-ND; MANUFACTURER: Murata Power Solutions Inc.; MOPN: 580-OKI78SR12/1W36C; MPN: OKI-78SR-12/1.0-W36-C
C8 C24 C40 = HyTechDevices:CAPACITOR_?_*: Capacitor, Non-Polarized VJ...1BC Series Datasheet <https://www.mouser.com/datasheet/2/427/vjw1bcbascomseries-1762447.pdf> Samsung Datasheet <https://www.mouser.com/datasheet/2/585/MLCC-1837944.pdf> Walsin Datasheet <https://www.mouser.com/datasheet/2/210/WTC_MLCC_General_Purpose-1534899.pdf> GRM188R61A226ME15D <https://www.mouser.com/datasheet/2/281/1/GRM188R61A226ME15_02A-1985787.pdf> GRM188R61E106MA73D <https://www.mouser.com/datasheet/2/281/1/GRM188R61E106MA73_01A-1985806.pdf> 885012006013 <https://www.mouser.com/datasheet/2/445/885012006013-1726946.pdf> 2220Y6300105KXTWS2 <https://www.mouser.com/datasheet/2/218/SMD_High_and_Std_StackiCap_P62-1825512.pdf> Yageo Class 2, X5R <https://www.mouser.com/datasheet/2/447/UPY_GPHC_X5R_4V_to_50V_26-1827097.pdf> TDK C Series <https://www.mouser.com/ProductDetail/TDK/C3216X5R1V226M160AC?qs=%2Fha2pyFadujbcx9jh7lYl%2F4NeMoXFhdc8AqVWNq4wW6M2y7zl6GzBuhgtI0ngznN> AVX Automotive MLCC <https://www.mouser.com/datasheet/2/40/AutoMLCC-777028.pdf> KEMET X7R Series <https://www.mouser.com/datasheet/2/212/KEM_C1002_X7R_SMD-1102033.pdf> Kyocera AVX <https://www.mouser.com/datasheet/2/40/C0GNP0_Dielectric-951274.pdf> GRM21BR61H <https://www.mouser.com/datasheet/2/281/1/GRM21BR61H106KE43_01A-1986884.pdf> C1812W104KDRACTU <https://www.mouser.com/datasheet/2/212/KEM_C1034_X7R_HV_ARC_SMD-1101730.pdf>; CAPACITANCE: 10uF; DKPN: 490-18663-2-ND; MANUFACTURER: Murata; MOPN: 81-GRM21BR61H106KE3L; MPN: GRM21BR61H106KE43L; TOLERANCE: 10%; VOLTAGE: 50V
C10-C12 C16 C34 C38 = HyTechDevices:CAPACITOR_?_*: Capacitor, Non-Polarized VJ...1BC Series Datasheet <https://www.mouser.com/datasheet/2/427/vjw1bcbascomseries-1762447.pdf> Samsung Datasheet <https://www.mouser.com/datasheet/2/585/MLCC-1837944.pdf> Walsin Datasheet <https://www.mouser.com/datasheet/2/210/WTC_MLCC_General_Purpose-1534899.pdf> GRM188R61A226ME15D <https://www.mouser.com/datasheet/2/281/1/GRM188R61A226ME15_02A-1985787.pdf> GRM188R61E106MA73D <https://www.mouser.com/datasheet/2/281/1/GRM188R61E106MA73_01A-1985806.pdf> 885012006013 <https://www.mouser.com/datasheet/2/445/885012006013-1726946.pdf> 2220Y6300105KXTWS2 <https://www.mouser.com/datasheet/2/218/SMD_High_and_Std_StackiCap_P62-1825512.pdf> Yageo Class 2, X5R <https://www.mouser.com/datasheet/2/447/UPY_GPHC_X5R_4V_to_50V_26-1827097.pdf> TDK C Series <https://www.mouser.com/ProductDetail/TDK/C3216X5R1V226M160AC?qs=%2Fha2pyFadujbcx9jh7lYl%2F4NeMoXFhdc8AqVWNq4wW6M2y7zl6GzBuhgtI0ngznN> AVX Automotive MLCC <https://www.mouser.com/datasheet/2/40/AutoMLCC-777028.pdf> KEMET X7R Series <https://www.mouser.com/datasheet/2/212/KEM_C1002_X7R_SMD-1102033.pdf> Kyocera AVX <https://www.mouser.com/datasheet/2/40/C0GNP0_Dielectric-951274.pdf> GRM21BR61H <https://www.mouser.com/datasheet/2/281/1/GRM21BR61H106KE43_01A-1986884.pdf> C1812W104KDRACTU <https://www.mouser.com/datasheet/2/212/KEM_C1034_X7R_HV_ARC_SMD-1101730.pdf>; CAPACITANCE: 0.1µF; DKPN: 720-1688-1-ND; MANUFACTURER: Vishay Vitramon; MOPN: 77-VJ0603Y104JXQPBC; MPN: VJ0603Y104JXQPW1BC; TOLERANCE: 5%; VOLTAGE: 10V
C15 = HyTechDevices:CAPACITOR_?_*: Capacitor, Non-Polarized VJ...1BC Series Datasheet <https://www.mouser.com/datasheet/2/427/vjw1bcbascomseries-1762447.pdf> Samsung Datasheet <https://www.mouser.com/datasheet/2/585/MLCC-1837944.pdf> Walsin Datasheet <https://www.mouser.com/datasheet/2/210/WTC_MLCC_General_Purpose-1534899.pdf> GRM188R61A226ME15D <https://www.mouser.com/datasheet/2/281/1/GRM188R61A226ME15_02A-1985787.pdf> GRM188R61E106MA73D <https://www.mouser.com/datasheet/2/281/1/GRM188R61E106MA73_01A-1985806.pdf> 885012006013 <https://www.mouser.com/datasheet/2/445/885012006013-1726946.pdf> 2220Y6300105KXTWS2 <https://www.mouser.com/datasheet/2/218/SMD_High_and_Std_StackiCap_P62-1825512.pdf> Yageo Class 2, X5R <https://www.mouser.com/datasheet/2/447/UPY_GPHC_X5R_4V_to_50V_26-1827097.pdf> TDK C Series <https://www.mouser.com/ProductDetail/TDK/C3216X5R1V226M160AC?qs=%2Fha2pyFadujbcx9jh7lYl%2F4NeMoXFhdc8AqVWNq4wW6M2y7zl6GzBuhgtI0ngznN> AVX Automotive MLCC <https://www.mouser.com/datasheet/2/40/AutoMLCC-777028.pdf> KEMET X7R Series <https://www.mouser.com/datasheet/2/212/KEM_C1002_X7R_SMD-1102033.pdf> Kyocera AVX <https://www.mouser.com/datasheet/2/40/C0GNP0_Dielectric-951274.pdf> GRM21BR61H <https://www.mouser.com/datasheet/2/281/1/GRM21BR61H106KE43_01A-1986884.pdf> C1812W104KDRACTU <https://www.mouser.com/datasheet/2/212/KEM_C1034_X7R_HV_ARC_SMD-1101730.pdf>; CAPACITANCE: 0.1µF; DKPN: 1276-1006-1-ND; MANUFACTURER: Samsung Electro-Mechanics; MOPN: 187-CL10B104KA8NNNC; MPN: CL10B104KA8NNNC; TOLERANCE: 10%; VOLTAGE: 25V
C17 = HyTechDevices:CAPACITOR_?_*: Capacitor, Non-Polarized VJ...1BC Series Datasheet <https://www.mouser.com/datasheet/2/427/vjw1bcbascomseries-1762447.pdf> Samsung Datasheet <https://www.mouser.com/datasheet/2/585/MLCC-1837944.pdf> Walsin Datasheet <https://www.mouser.com/datasheet/2/210/WTC_MLCC_General_Purpose-1534899.pdf> GRM188R61A226ME15D <https://www.mouser.com/datasheet/2/281/1/GRM188R61A226ME15_02A-1985787.pdf> GRM188R61E106MA73D <https://www.mouser.com/datasheet/2/281/1/GRM188R61E106MA73_01A-1985806.pdf> 885012006013 <https://www.mouser.com/datasheet/2/445/885012006013-1726946.pdf> 2220Y6300105KXTWS2 <https://www.mouser.com/datasheet/2/218/SMD_High_and_Std_StackiCap_P62-1825512.pdf> Yageo Class 2, X5R <https://www.mouser.com/datasheet/2/447/UPY_GPHC_X5R_4V_to_50V_26-1827097.pdf> TDK C Series <https://www.mouser.com/ProductDetail/TDK/C3216X5R1V226M160AC?qs=%2Fha2pyFadujbcx9jh7lYl%2F4NeMoXFhdc8AqVWNq4wW6M2y7zl6GzBuhgtI0ngznN> AVX Automotive MLCC <https://www.mouser.com/datasheet/2/40/AutoMLCC-777028.pdf> KEMET X7R Series <https://www.mouser.com/datasheet/2/212/KEM_C1002_X7R_SMD-1102033.pdf> Kyocera AVX <https://www.mouser.com/datasheet/2/40/C0GNP0_Dielectric-951274.pdf> GRM21BR61H <https://www.mouser.com/datasheet/2/281/1/GRM21BR61H106KE43_01A-1986884.pdf> C1812W104KDRACTU <https://www.mouser.com/datasheet/2/212/KEM_C1034_X7R_HV_ARC_SMD-1101730.pdf>; CAPACITANCE: 1.2nF; DKPN: 311-4079-2-ND; MANUFACTURER: YAGEO; MOPN: 603-CC603KRX7R8BB122; MPN: CC0603KRX7R8BB122; TOLERANCE: 10%; VOLTAGE: 25V
C25 = HyTechDevices:CAPACITOR_?_*: Capacitor, Non-Polarized VJ...1BC Series Datasheet <https://www.mouser.com/datasheet/2/427/vjw1bcbascomseries-1762447.pdf> Samsung Datasheet <https://www.mouser.com/datasheet/2/585/MLCC-1837944.pdf> Walsin Datasheet <https://www.mouser.com/datasheet/2/210/WTC_MLCC_General_Purpose-1534899.pdf> GRM188R61A226ME15D <https://www.mouser.com/datasheet/2/281/1/GRM188R61A226ME15_02A-1985787.pdf> GRM188R61E106MA73D <https://www.mouser.com/datasheet/2/281/1/GRM188R61E106MA73_01A-1985806.pdf> 885012006013 <https://www.mouser.com/datasheet/2/445/885012006013-1726946.pdf> 2220Y6300105KXTWS2 <https://www.mouser.com/datasheet/2/218/SMD_High_and_Std_StackiCap_P62-1825512.pdf> Yageo Class 2, X5R <https://www.mouser.com/datasheet/2/447/UPY_GPHC_X5R_4V_to_50V_26-1827097.pdf> TDK C Series <https://www.mouser.com/ProductDetail/TDK/C3216X5R1V226M160AC?qs=%2Fha2pyFadujbcx9jh7lYl%2F4NeMoXFhdc8AqVWNq4wW6M2y7zl6GzBuhgtI0ngznN> AVX Automotive MLCC <https://www.mouser.com/datasheet/2/40/AutoMLCC-777028.pdf> KEMET X7R Series <https://www.mouser.com/datasheet/2/212/KEM_C1002_X7R_SMD-1102033.pdf> Kyocera AVX <https://www.mouser.com/datasheet/2/40/C0GNP0_Dielectric-951274.pdf> GRM21BR61H <https://www.mouser.com/datasheet/2/281/1/GRM21BR61H106KE43_01A-1986884.pdf> C1812W104KDRACTU <https://www.mouser.com/datasheet/2/212/KEM_C1034_X7R_HV_ARC_SMD-1101730.pdf>; CAPACITANCE: 4.7nF; DKPN: 732-7931-1-ND; MANUFACTURER: Würth Elektronik; MOPN: 710-885012206012; MPN: 885012206012; TOLERANCE: 10%; VOLTAGE: 10V
C33 = HyTechDevices:CAPACITOR_?_*: Capacitor, Non-Polarized VJ...1BC Series Datasheet <https://www.mouser.com/datasheet/2/427/vjw1bcbascomseries-1762447.pdf> Samsung Datasheet <https://www.mouser.com/datasheet/2/585/MLCC-1837944.pdf> Walsin Datasheet <https://www.mouser.com/datasheet/2/210/WTC_MLCC_General_Purpose-1534899.pdf> GRM188R61A226ME15D <https://www.mouser.com/datasheet/2/281/1/GRM188R61A226ME15_02A-1985787.pdf> GRM188R61E106MA73D <https://www.mouser.com/datasheet/2/281/1/GRM188R61E106MA73_01A-1985806.pdf> 885012006013 <https://www.mouser.com/datasheet/2/445/885012006013-1726946.pdf> 2220Y6300105KXTWS2 <https://www.mouser.com/datasheet/2/218/SMD_High_and_Std_StackiCap_P62-1825512.pdf> Yageo Class 2, X5R <https://www.mouser.com/datasheet/2/447/UPY_GPHC_X5R_4V_to_50V_26-1827097.pdf> TDK C Series <https://www.mouser.com/ProductDetail/TDK/C3216X5R1V226M160AC?qs=%2Fha2pyFadujbcx9jh7lYl%2F4NeMoXFhdc8AqVWNq4wW6M2y7zl6GzBuhgtI0ngznN> AVX Automotive MLCC <https://www.mouser.com/datasheet/2/40/AutoMLCC-777028.pdf> KEMET X7R Series <https://www.mouser.com/datasheet/2/212/KEM_C1002_X7R_SMD-1102033.pdf> Kyocera AVX <https://www.mouser.com/datasheet/2/40/C0GNP0_Dielectric-951274.pdf> GRM21BR61H <https://www.mouser.com/datasheet/2/281/1/GRM21BR61H106KE43_01A-1986884.pdf> C1812W104KDRACTU <https://www.mouser.com/datasheet/2/212/KEM_C1034_X7R_HV_ARC_SMD-1101730.pdf>; CAPACITANCE: 10µF; DKPN: 490-7202-1-ND; MANUFACTURER: Murata Electronics; MOPN: 81-GRM188R61E106MA3D; MPN: GRM188R61E106MA73D; TOLERANCE: 20%; VOLTAGE: 25V
C39 = HyTechDevices:CAPACITOR_?_*: Capacitor, Non-Polarized VJ...1BC Series Datasheet <https://www.mouser.com/datasheet/2/427/vjw1bcbascomseries-1762447.pdf> Samsung Datasheet <https://www.mouser.com/datasheet/2/585/MLCC-1837944.pdf> Walsin Datasheet <https://www.mouser.com/datasheet/2/210/WTC_MLCC_General_Purpose-1534899.pdf> GRM188R61A226ME15D <https://www.mouser.com/datasheet/2/281/1/GRM188R61A226ME15_02A-1985787.pdf> GRM188R61E106MA73D <https://www.mouser.com/datasheet/2/281/1/GRM188R61E106MA73_01A-1985806.pdf> 885012006013 <https://www.mouser.com/datasheet/2/445/885012006013-1726946.pdf> 2220Y6300105KXTWS2 <https://www.mouser.com/datasheet/2/218/SMD_High_and_Std_StackiCap_P62-1825512.pdf> Yageo Class 2, X5R <https://www.mouser.com/datasheet/2/447/UPY_GPHC_X5R_4V_to_50V_26-1827097.pdf> TDK C Series <https://www.mouser.com/ProductDetail/TDK/C3216X5R1V226M160AC?qs=%2Fha2pyFadujbcx9jh7lYl%2F4NeMoXFhdc8AqVWNq4wW6M2y7zl6GzBuhgtI0ngznN> AVX Automotive MLCC <https://www.mouser.com/datasheet/2/40/AutoMLCC-777028.pdf> KEMET X7R Series <https://www.mouser.com/datasheet/2/212/KEM_C1002_X7R_SMD-1102033.pdf> Kyocera AVX <https://www.mouser.com/datasheet/2/40/C0GNP0_Dielectric-951274.pdf> GRM21BR61H <https://www.mouser.com/datasheet/2/281/1/GRM21BR61H106KE43_01A-1986884.pdf> C1812W104KDRACTU <https://www.mouser.com/datasheet/2/212/KEM_C1034_X7R_HV_ARC_SMD-1101730.pdf>; CAPACITANCE: 1µF; DKPN: 311-1796-1-ND; MANUFACTURER: Yageo; MOPN: 603-CC603KRX7R6BB105; MPN: CC0603KRX7R6BB105; TOLERANCE: 10%; VOLTAGE: 10V
D1 = HyTechDevices:LED_?_*: LED; COLOR: Yellow; DKPN: 754-1788-1-ND; MANUFACTURER: Kingbright; MOPN: 604-APT1608SYCK/J3-PRV; MPN: APT1608SYCK/J3-PRV
D3-D6 = HyTechDevices:TVS_?_*: TVS Diode GSOT Datasheet <https://www.mouser.com/datasheet/2/427/gsot03-1767593.pdf>; DKPN: 118-1.5SMBJ30ATR-ND; MANUFACTURER: Bourns Inc.; MOPN: 652-1.5SMBJ30A; MPN: 1.5SMBJ30A; VOLTAGE: 30V
D101 = HyTechDevices:LED_7_SEGMENT_: Low-Profile 7-Segment Display DSM7T Blue <https://vcclite.com/wp-content/uploads/wpallimport/files/files/DSM7TA56106T.pdf> DSM7T Green <https://vcclite.com/wp-content/uploads/wpallimport/files/files/DSM7TA56105T.pdf>; COLOR: Blue; DKPN: DSM7TA56106TTR-ND; MANUFACTURER: Visual Communications Company; MOPN: 593-DSM7TA56106T; MPN: DSM7TA56106T
J2 = HyTechDevices:CONNECTOR-8_?_*: 8 Pin Connector; DKPN: WM1834CT-ND; MANUFACTURER: Molex; MOPN: 538-43045-0811; MPN: 0430450811
J3 = HyTechDevices:CONNECTOR-CAN_?_*: HyTech CAN Connector; DKPN: WM1832CT-ND; MANUFACTURER: Molex; MOPN: 538-43045-0411; MPN: 0430450411
J4 J6 = HyTechDevices:CONNECTOR-6_?_*: 6 Pin Connector; DKPN: WM1833CT-ND; MANUFACTURER: Molex; MOPN: 538-43045-0611; MPN: 0430450611
JP1 = HyTechDevices:JUMPER_?_*: 2 Pin Connector; DKPN: 13-RC0603FR-130RLTR-ND; MANUFACTURER: YAGEO; MOPN: 603-RC0603FR-130RL; MPN: RC0603FR-130RL
LS100 = HyTechDevices:BUZZER_3_PIN_: 3 Pin Buzzer CPT-3011C-120 Datasheet <https://www.cuidevices.com/product/resource/cpt-3011c-120.pdf>; DKPN: 102-3762-ND; FREQUENCY: 3kHz; MANUFACTURER: CUI Devices; MOPN: 490-CPT-3011C-120; MPN: CPT-3011C-120; VOLTAGE: 12V; VOLUME: 85dB
R1 R2 R6 R10 = HyTechDevices:RESISTOR_?_*: Resistor PWR163 Series <https://www.mouser.com/datasheet/2/54/pwr163-777985.pdf> AC Series <https://www.mouser.com/datasheet/2/447/Yageo_PYu_AC_51_RoHS_L_7_1714230-1874691.pdf> PU Series <https://www.mouser.com/datasheet/2/447/PYu-PU_51_RoHS_L_6-1504619.pdf> ERA Series <https://www.mouser.com/datasheet/2/315/AOA0000C307-1149632.pdf> PWR263 Series <https://www.mouser.com/datasheet/2/54/pwr263s_35-778069.pdf> KTR Series <https://www.mouser.com/datasheet/2/348/ROHM_S_A0011075115_1-2563276.pdf> RC Series <https://www.mouser.com/datasheet/2/447/Yageo_03_18_2021_PYu_RC_Group_51_RoHS_L_11-2199992.pdf> ERJ PB3, PB6 Series <https://www.mouser.com/datasheet/2/315/AOA0000C328-1530132.pdf> ERJ PA2, P03, PA3, P06, P08, P14 Series <https://www.mouser.com/datasheet/2/315/AOA0000C331-1141874.pdf> B20 Series <https://www.ohmite.com/assets/docs/res_200.pdf?r=false> TE Connectivity/Holsworthy RN73 Series <https://www.mouser.com/datasheet/2/418/4/NG_DS_1773270_M-604713.pdf> Vishay Dale D/CRCW e3 <https://www.mouser.com/datasheet/2/427/dcrcwe3-1762152.pdf> Ohmite B20 <https://www.ohmite.com/assets/docs/res_200.pdf?r=false>; DKPN: 1712-CPF-A-0603B1K0ETR-ND; MANUFACTURER: TE Connectivity Passive Product; MOPN: 279-CPF-A-0603B1K0E; MPN: CPF-A-0603B1K0E; POWER: 0.0625W; RESISTANCE: 1k; TOLERANCE: 0.1%; VOLTAGE_CONTINUOUS: 7.9V; VOLTAGE_MAX: 50V
R3-R5 = HyTechDevices:RESISTOR_?_*: Resistor PWR163 Series <https://www.mouser.com/datasheet/2/54/pwr163-777985.pdf> AC Series <https://www.mouser.com/datasheet/2/447/Yageo_PYu_AC_51_RoHS_L_7_1714230-1874691.pdf> PU Series <https://www.mouser.com/datasheet/2/447/PYu-PU_51_RoHS_L_6-1504619.pdf> ERA Series <https://www.mouser.com/datasheet/2/315/AOA0000C307-1149632.pdf> PWR263 Series <https://www.mouser.com/datasheet/2/54/pwr263s_35-778069.pdf> KTR Series <https://www.mouser.com/datasheet/2/348/ROHM_S_A0011075115_1-2563276.pdf> RC Series <https://www.mouser.com/datasheet/2/447/Yageo_03_18_2021_PYu_RC_Group_51_RoHS_L_11-2199992.pdf> ERJ PB3, PB6 Series <https://www.mouser.com/datasheet/2/315/AOA0000C328-1530132.pdf> ERJ PA2, P03, PA3, P06, P08, P14 Series <https://www.mouser.com/datasheet/2/315/AOA0000C331-1141874.pdf> B20 Series <https://www.ohmite.com/assets/docs/res_200.pdf?r=false> TE Connectivity/Holsworthy RN73 Series <https://www.mouser.com/datasheet/2/418/4/NG_DS_1773270_M-604713.pdf> Vishay Dale D/CRCW e3 <https://www.mouser.com/datasheet/2/427/dcrcwe3-1762152.pdf> Ohmite B20 <https://www.ohmite.com/assets/docs/res_200.pdf?r=false>; DKPN: P20155CT-ND; MANUFACTURER: Panasonic Electronic Components; MOPN: 667-ERJ-PB3B4122V; MPN: ERJ-PB3B4122V; POWER: 0.2W; RESISTANCE: 41.2k; TOLERANCE: 0.1%; VOLTAGE_CONTINUOUS: 150V; VOLTAGE_MAX: 200V
R8 R12 R14 = HyTechDevices:RESISTOR_?_*: Resistor PWR163 Series <https://www.mouser.com/datasheet/2/54/pwr163-777985.pdf> AC Series <https://www.mouser.com/datasheet/2/447/Yageo_PYu_AC_51_RoHS_L_7_1714230-1874691.pdf> PU Series <https://www.mouser.com/datasheet/2/447/PYu-PU_51_RoHS_L_6-1504619.pdf> ERA Series <https://www.mouser.com/datasheet/2/315/AOA0000C307-1149632.pdf> PWR263 Series <https://www.mouser.com/datasheet/2/54/pwr263s_35-778069.pdf> KTR Series <https://www.mouser.com/datasheet/2/348/ROHM_S_A0011075115_1-2563276.pdf> RC Series <https://www.mouser.com/datasheet/2/447/Yageo_03_18_2021_PYu_RC_Group_51_RoHS_L_11-2199992.pdf> ERJ PB3, PB6 Series <https://www.mouser.com/datasheet/2/315/AOA0000C328-1530132.pdf> ERJ PA2, P03, PA3, P06, P08, P14 Series <https://www.mouser.com/datasheet/2/315/AOA0000C331-1141874.pdf> B20 Series <https://www.ohmite.com/assets/docs/res_200.pdf?r=false> TE Connectivity/Holsworthy RN73 Series <https://www.mouser.com/datasheet/2/418/4/NG_DS_1773270_M-604713.pdf> Vishay Dale D/CRCW e3 <https://www.mouser.com/datasheet/2/427/dcrcwe3-1762152.pdf> Ohmite B20 <https://www.ohmite.com/assets/docs/res_200.pdf?r=false>; DKPN: 311-5.10KHRTR-ND; MANUFACTURER: Yageo; MOPN: 603-RC0603FR-075K1L; MPN: RC0603FR-075K1L; POWER: 0.1W; RESISTANCE: 5.1k; TOLERANCE: 1%; VOLTAGE_CONTINUOUS: 22.58V; VOLTAGE_MAX: 75V
R9 = HyTechDevices:RESISTOR_?_*: Resistor PWR163 Series <https://www.mouser.com/datasheet/2/54/pwr163-777985.pdf> AC Series <https://www.mouser.com/datasheet/2/447/Yageo_PYu_AC_51_RoHS_L_7_1714230-1874691.pdf> PU Series <https://www.mouser.com/datasheet/2/447/PYu-PU_51_RoHS_L_6-1504619.pdf> ERA Series <https://www.mouser.com/datasheet/2/315/AOA0000C307-1149632.pdf> PWR263 Series <https://www.mouser.com/datasheet/2/54/pwr263s_35-778069.pdf> KTR Series <https://www.mouser.com/datasheet/2/348/ROHM_S_A0011075115_1-2563276.pdf> RC Series <https://www.mouser.com/datasheet/2/447/Yageo_03_18_2021_PYu_RC_Group_51_RoHS_L_11-2199992.pdf> ERJ PB3, PB6 Series <https://www.mouser.com/datasheet/2/315/AOA0000C328-1530132.pdf> ERJ PA2, P03, PA3, P06, P08, P14 Series <https://www.mouser.com/datasheet/2/315/AOA0000C331-1141874.pdf> B20 Series <https://www.ohmite.com/assets/docs/res_200.pdf?r=false> TE Connectivity/Holsworthy RN73 Series <https://www.mouser.com/datasheet/2/418/4/NG_DS_1773270_M-604713.pdf> Vishay Dale D/CRCW e3 <https://www.mouser.com/datasheet/2/427/dcrcwe3-1762152.pdf> Ohmite B20 <https://www.ohmite.com/assets/docs/res_200.pdf?r=false>; DKPN: P150KDBCT-ND; MANUFACTURER: Panasonic Electronic Components; MOPN: 667-ERA-3AEB154V; MPN: ERA-3AEB154V; POWER: 0.1W; RESISTANCE: 150k; TOLERANCE: 1%; VOLTAGE_CONTINUOUS: 75V; VOLTAGE_MAX: 75V
R11 = HyTechDevices:RESISTOR_?_*: Resistor PWR163 Series <https://www.mouser.com/datasheet/2/54/pwr163-777985.pdf> AC Series <https://www.mouser.com/datasheet/2/447/Yageo_PYu_AC_51_RoHS_L_7_1714230-1874691.pdf> PU Series <https://www.mouser.com/datasheet/2/447/PYu-PU_51_RoHS_L_6-1504619.pdf> ERA Series <https://www.mouser.com/datasheet/2/315/AOA0000C307-1149632.pdf> PWR263 Series <https://www.mouser.com/datasheet/2/54/pwr263s_35-778069.pdf> KTR Series <https://www.mouser.com/datasheet/2/348/ROHM_S_A0011075115_1-2563276.pdf> RC Series <https://www.mouser.com/datasheet/2/447/Yageo_03_18_2021_PYu_RC_Group_51_RoHS_L_11-2199992.pdf> ERJ PB3, PB6 Series <https://www.mouser.com/datasheet/2/315/AOA0000C328-1530132.pdf> ERJ PA2, P03, PA3, P06, P08, P14 Series <https://www.mouser.com/datasheet/2/315/AOA0000C331-1141874.pdf> B20 Series <https://www.ohmite.com/assets/docs/res_200.pdf?r=false> TE Connectivity/Holsworthy RN73 Series <https://www.mouser.com/datasheet/2/418/4/NG_DS_1773270_M-604713.pdf> Vishay Dale D/CRCW e3 <https://www.mouser.com/datasheet/2/427/dcrcwe3-1762152.pdf> Ohmite B20 <https://www.ohmite.com/assets/docs/res_200.pdf?r=false>; DKPN: P10KBDCT-ND; MANUFACTURER: Panasonic Electronic Components; MOPN: 667-ERA-3ARB103V; MPN: ERA-3ARB103V; POWER: 0.1W; RESISTANCE: 10k; TOLERANCE: 0.1%; VOLTAGE_CONTINUOUS: 31.62V; VOLTAGE_MAX: 75V
R13 = HyTechDevices:RESISTOR_?_*: Resistor PWR163 Series <https://www.mouser.com/datasheet/2/54/pwr163-777985.pdf> AC Series <https://www.mouser.com/datasheet/2/447/Yageo_PYu_AC_51_RoHS_L_7_1714230-1874691.pdf> PU Series <https://www.mouser.com/datasheet/2/447/PYu-PU_51_RoHS_L_6-1504619.pdf> ERA Series <https://www.mouser.com/datasheet/2/315/AOA0000C307-1149632.pdf> PWR263 Series <https://www.mouser.com/datasheet/2/54/pwr263s_35-778069.pdf> KTR Series <https://www.mouser.com/datasheet/2/348/ROHM_S_A0011075115_1-2563276.pdf> RC Series <https://www.mouser.com/datasheet/2/447/Yageo_03_18_2021_PYu_RC_Group_51_RoHS_L_11-2199992.pdf> ERJ PB3, PB6 Series <https://www.mouser.com/datasheet/2/315/AOA0000C328-1530132.pdf> ERJ PA2, P03, PA3, P06, P08, P14 Series <https://www.mouser.com/datasheet/2/315/AOA0000C331-1141874.pdf> B20 Series <https://www.ohmite.com/assets/docs/res_200.pdf?r=false> TE Connectivity/Holsworthy RN73 Series <https://www.mouser.com/datasheet/2/418/4/NG_DS_1773270_M-604713.pdf> Vishay Dale D/CRCW e3 <https://www.mouser.com/datasheet/2/427/dcrcwe3-1762152.pdf> Ohmite B20 <https://www.ohmite.com/assets/docs/res_200.pdf?r=false>; DKPN: 311-1.50MHRCT-ND; MANUFACTURER: Yageo; MOPN: 603-RC0603FR-071M5L; MPN: RC0603FR-071M5L; POWER: 0.1W; RESISTANCE: 1.5M; TOLERANCE: 1%; VOLTAGE_CONTINUOUS: 75V; VOLTAGE_MAX: 75V
R36 R60 = HyTechDevices:RESISTOR_?_*: Resistor PWR163 Series <https://www.mouser.com/datasheet/2/54/pwr163-777985.pdf> AC Series <https://www.mouser.com/datasheet/2/447/Yageo_PYu_AC_51_RoHS_L_7_1714230-1874691.pdf> PU Series <https://www.mouser.com/datasheet/2/447/PYu-PU_51_RoHS_L_6-1504619.pdf> ERA Series <https://www.mouser.com/datasheet/2/315/AOA0000C307-1149632.pdf> PWR263 Series <https://www.mouser.com/datasheet/2/54/pwr263s_35-778069.pdf> KTR Series <https://www.mouser.com/datasheet/2/348/ROHM_S_A0011075115_1-2563276.pdf> RC Series <https://www.mouser.com/datasheet/2/447/Yageo_03_18_2021_PYu_RC_Group_51_RoHS_L_11-2199992.pdf> ERJ PB3, PB6 Series <https://www.mouser.com/datasheet/2/315/AOA0000C328-1530132.pdf> ERJ PA2, P03, PA3, P06, P08, P14 Series <https://www.mouser.com/datasheet/2/315/AOA0000C331-1141874.pdf> B20 Series <https://www.ohmite.com/assets/docs/res_200.pdf?r=false> TE Connectivity/Holsworthy RN73 Series <https://www.mouser.com/datasheet/2/418/4/NG_DS_1773270_M-604713.pdf> Vishay Dale D/CRCW e3 <https://www.mouser.com/datasheet/2/427/dcrcwe3-1762152.pdf> Ohmite B20 <https://www.ohmite.com/assets/docs/res_200.pdf?r=false>; DKPN: 311-60.4HRCT-ND; MANUFACTURER: Yageo; MOPN: 603-RC0603FR-0760R4L; MPN: RC0603FR-0760R4L; POWER: 0.1W; RESISTANCE: 60.4; TOLERANCE: 1%; VOLTAGE_CONTINUOUS: 2.48V; VOLTAGE_MAX: 75V
R83 = HyTechDevices:RESISTOR_?_*: Resistor PWR163 Series <https://www.mouser.com/datasheet/2/54/pwr163-777985.pdf> AC Series <https://www.mouser.com/datasheet/2/447/Yageo_PYu_AC_51_RoHS_L_7_1714230-1874691.pdf> PU Series <https://www.mouser.com/datasheet/2/447/PYu-PU_51_RoHS_L_6-1504619.pdf> ERA Series <https://www.mouser.com/datasheet/2/315/AOA0000C307-1149632.pdf> PWR263 Series <https://www.mouser.com/datasheet/2/54/pwr263s_35-778069.pdf> KTR Series <https://www.mouser.com/datasheet/2/348/ROHM_S_A0011075115_1-2563276.pdf> RC Series <https://www.mouser.com/datasheet/2/447/Yageo_03_18_2021_PYu_RC_Group_51_RoHS_L_11-2199992.pdf> ERJ PB3, PB6 Series <https://www.mouser.com/datasheet/2/315/AOA0000C328-1530132.pdf> ERJ PA2, P03, PA3, P06, P08, P14 Series <https://www.mouser.com/datasheet/2/315/AOA0000C331-1141874.pdf> B20 Series <https://www.ohmite.com/assets/docs/res_200.pdf?r=false> TE Connectivity/Holsworthy RN73 Series <https://www.mouser.com/datasheet/2/418/4/NG_DS_1773270_M-604713.pdf> Vishay Dale D/CRCW e3 <https://www.mouser.com/datasheet/2/427/dcrcwe3-1762152.pdf> Ohmite B20 <https://www.ohmite.com/assets/docs/res_200.pdf?r=false>; DKPN: P20340TR-ND; MANUFACTURER: Panasonic Electronic Components; MOPN: 667-ERJ-PB3D3301V; MPN: ERJ-PB3D3301V; POWER: 0.2W; RESISTANCE: 3.3k; TOLERANCE: 0.5%; VOLTAGE_CONTINUOUS: 25.69V; VOLTAGE_MAX: 150
RN2 RN4 = HyTechDevices:RESISTOR_NETWORK_4_*: Resistor Network, 4 Elements YC/TC Series <https://www.mouser.com/datasheet/2/447/yageo_yago_s_a0009164376_1-1991537.pdf> CAT/CAY 16 Series <https://www.mouser.com/datasheet/2/54/CATCAY-777361.pdf>; DKPN: YC164J-160CT-ND; MANUFACTURER: Yageo; MOPN: 603-YC164-JR-07160RL; MPN: YC164-JR-07160RL; POWER: 1/16W; RESISTANCE: 160; TOLERANCE: 5%; VOLTAGE: 50V
TP2-TP4 = HyTechDevices:TEST_POINT: Test Point for Probing; DKPN: 36-5015CT-ND; MANUFACTURER: Keystone Electronics; MOPN: 534-5015; MPN: 5015
TP_3.3V = HyTechDevices:TEST_POINT: Test Point for Probing; DKPN: 36-5015CT-ND; MANUFACTURER: Keystone Electronics; MOPN: 534-5015; MPN: 5015; SIGNAL: +3V3
TP_5V = HyTechDevices:TEST_POINT: Test Point for Probing; DKPN: 36-5015CT-ND; MANUFACTURER: Keystone Electronics; MOPN: 534-5015; MPN: 5015; SIGNAL: +5V
TP_12V TP_24V = HyTechDevices:TEST_POINT: Test Point for Probing; DKPN: 36-5015CT-ND; MANUFACTURER: Keystone Electronics; MOPN: 534-5015; MPN: 5015; SIGNAL: +12V
TP_GND = HyTechDevices:TEST_POINT: Test Point for Probing; DKPN: 36-5015CT-ND; MANUFACTURER: Keystone Electronics; MOPN: 534-5015; MPN: 5015; SIGNAL: GND
U1 U2 U4 U6-U15 = HyTechDevices:NEOPIXEL_*: IN-PI55QATPRPGPBPW-40 Neopixel RGBW LED Datasheet <https://www.mouser.com/datasheet/2/180/IN-PI55QATPRPGPBPW-XX_v1.3-1667471.pdf>; DKPN: 1830-1210-2-ND; MANUFACTURER: Inolux; MOPN: 743-I55QATPRPGPBPW40; MPN: IN-PI55QATPRPGPBPW-40
U3 = HyTechDevices:MCP23S08: IO Expander 8 Channel Datasheet <https://ww1.microchip.com/downloads/en/DeviceDoc/MCP23008-MCP23S08-Data-Sheet-20001919F.pdf>; DKPN: MCP23S08-E/SS-ND; MANUFACTURER: Microchip Technology; MOPN: 579-MCP23S08-E/SS; MPN: MCP23S08-E/SS
U5 = HyTechDevices:RE46C100: RE46C100 Piezoelectric Horn Driver IC Datasheet <https://ww1.microchip.com/downloads/en/DeviceDoc/20002166B.pdf>; DKPN: RE46C100S8TFTR-ND; MANUFACTURER: Microchip Technology; MOPN: 579-RE46C100S8TF; MPN: RE46C100S8TF
U27 = HyTechDevices:TCAN1051*V-Q1: TCAN1051*V Can Tranciever Datasheet <https://www.ti.com/lit/ds/symlink/tcan1051hgv-q1.pdf?HQS=dis-mous-null-mousermode-dsf-pf-null-wwe&ts=1610765132518&ref_url=https%253A%252F%252Fwww.mouser.com%252Ff>; DKPN: 296-49935-1-ND; MANUFACTURER: Texas Instruments; MOPN: 595-TCAN1051HGVDQ1; MPN: TCAN1051HGVDRQ1
XF1 = HyTechDevices:FUSE_HOLDER_*: Fuse Holder All PNs for the holder; if Miniblade Fuses <https://www.littelfuse.com/media?resourcetype=datasheets&itemid=0f5f58cb-559e-494b-8d53-723f30445ae5&filename=littelfuse-mini-datasheet> needed, order separately. Mini-Blade PTH <https://www.mouser.com/datasheet/2/215/3568-742601.pdf> Mini-Blade SMD <https://www.mouser.com/datasheet/2/215/588-744913.pdf> Littelfuse 122 Fuse Holder and Fuse Fuse <https://www.littelfuse.com/~/media/electronics/datasheets/fuses/littelfuse_fuse_508_datasheet.pdf.pdf> Fuse Holder <https://www.littelfuse.com/~/media/electronics/datasheets/fuse_clips/littelfuse_fuse_clip_102_122_datasheet.pdf.pdf>; DKPN: 36-3588-ND; FUSE_TYPE: MINI 297; MANUFACTURER: Keystone Electronics; MOPN: 534-3588; MPN: 3588

## Board
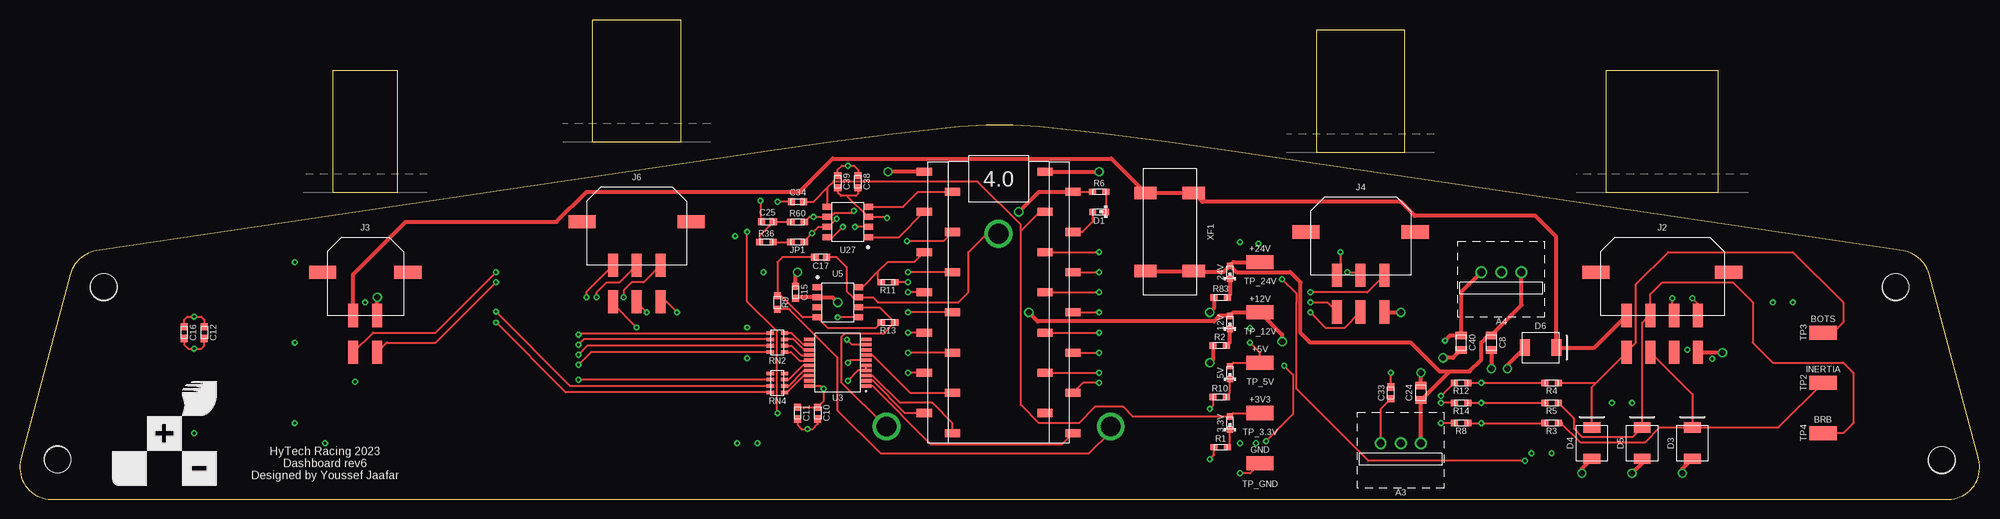
[diagram p5: board, top side]
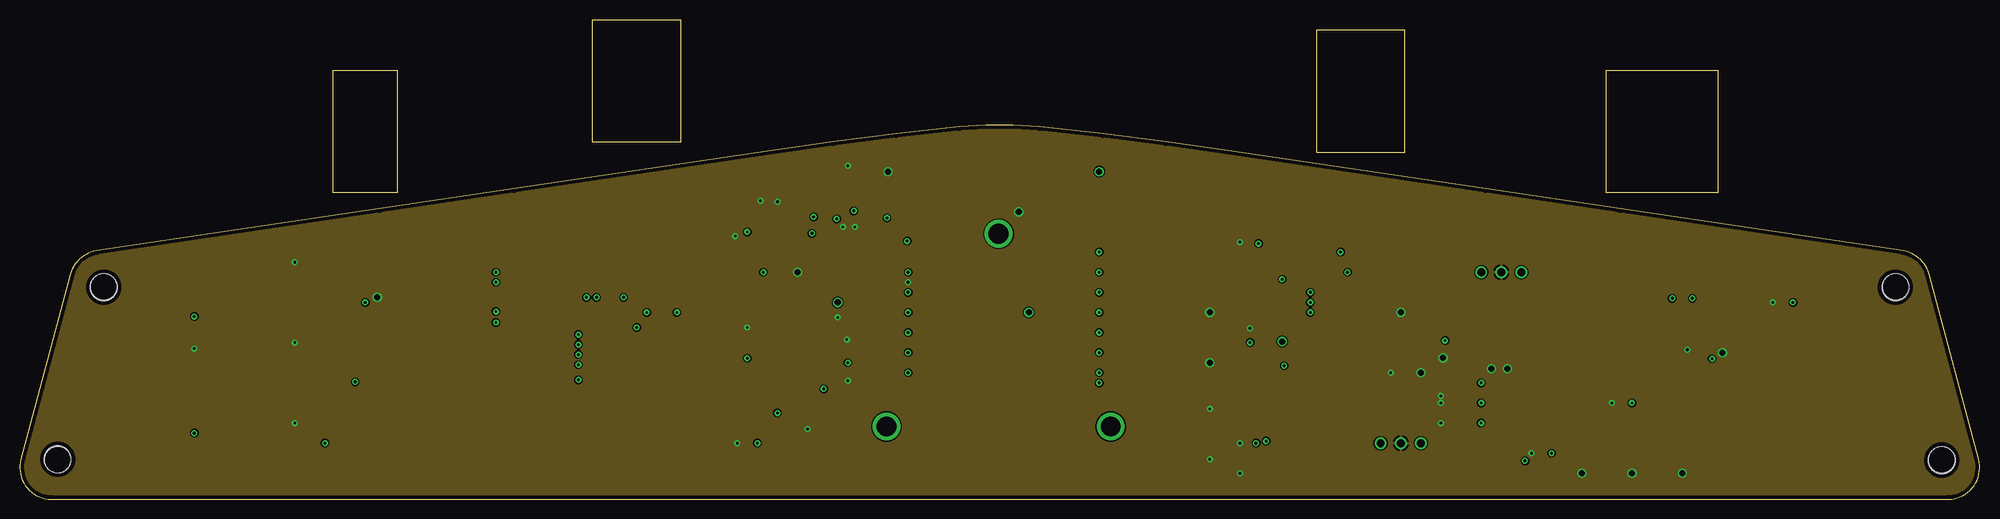
[diagram p6: board, inner layer Route2]
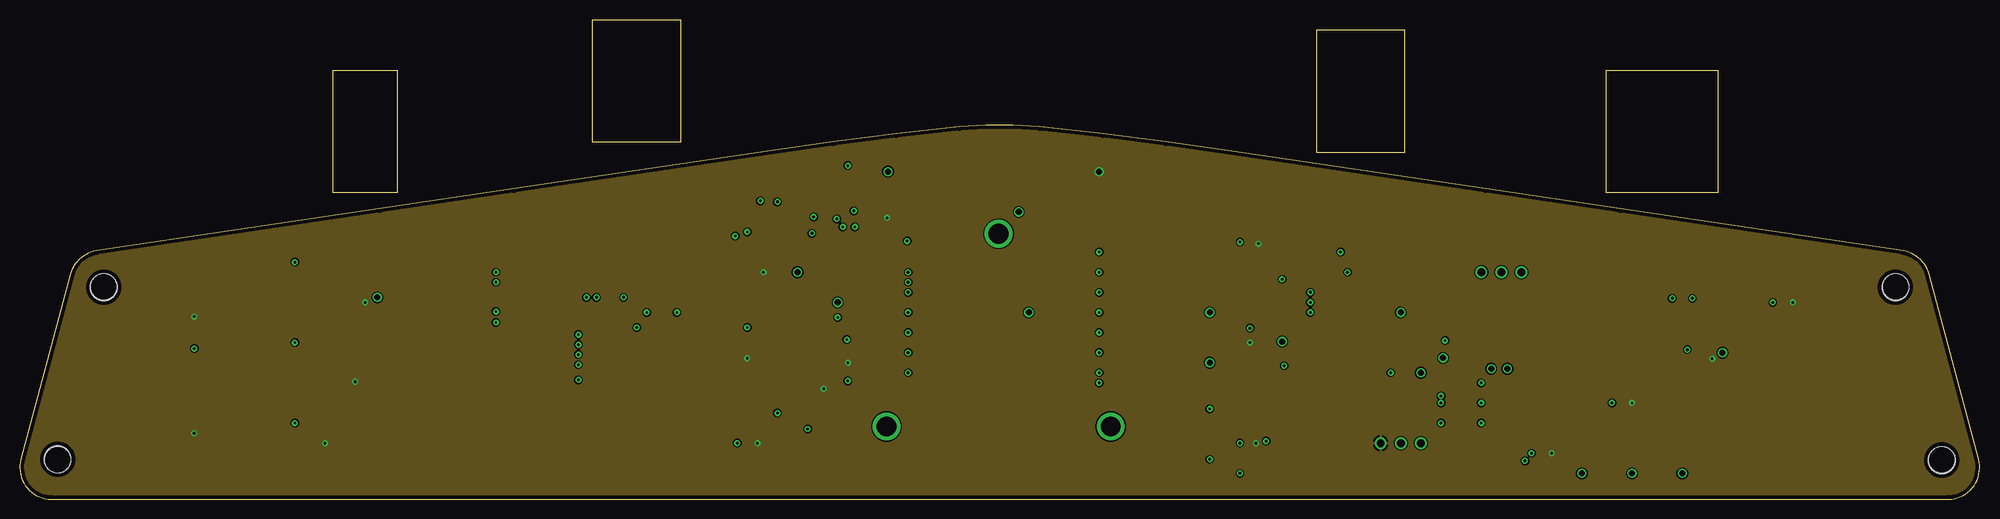
[diagram p7: board, inner layer Route15]
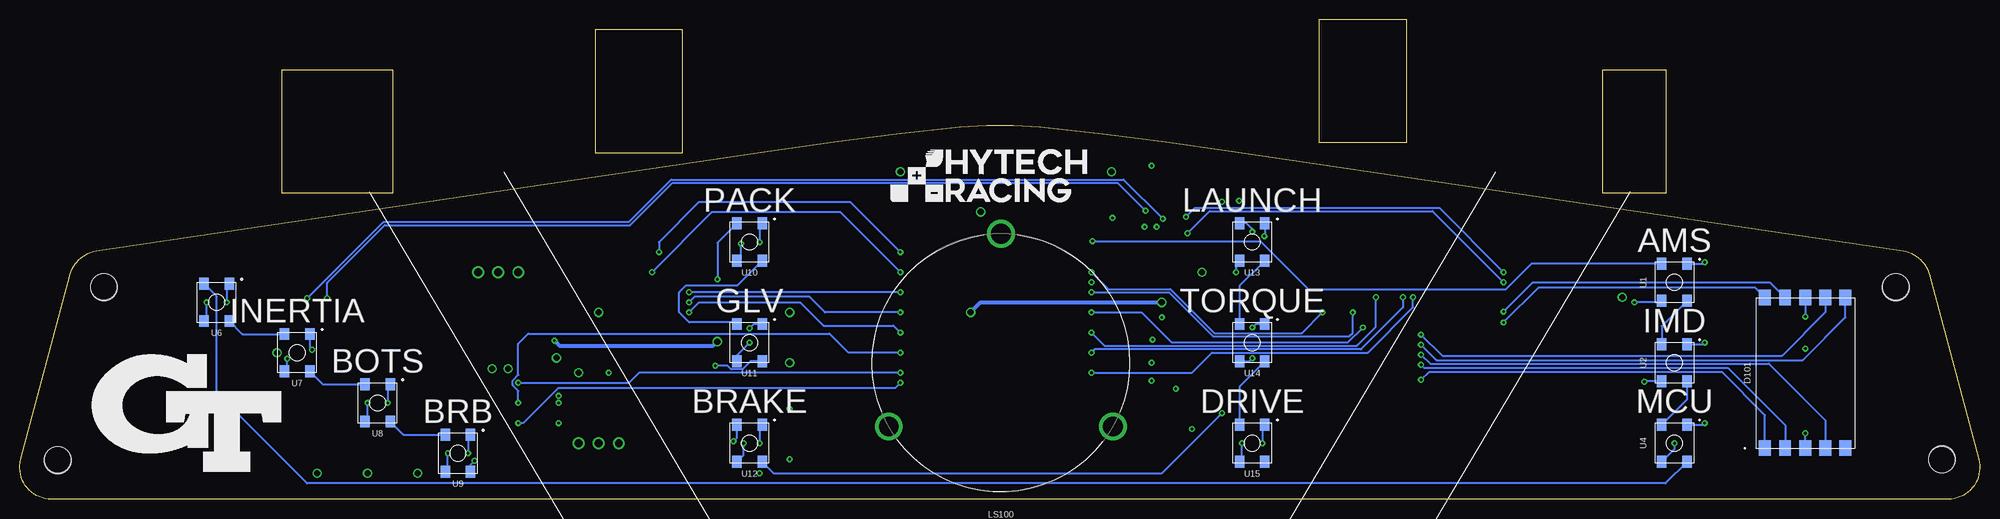
[diagram p8: board, bottom side, seen from below]

Size 247.57 x 47.23 mm. Coordinates in mm from the lower left corner, seen from the top.
Outline: 45.42,36.66 9.68,31.35 arc67 6.4,28.43 0.13,5.04 arc105 4,0 243.57,0 arc105 247.44,5.04 241.17,28.43 arc67 237.89,31.35 202.15,36.66 185.18,39.18 152.68,44.01 arc3 128.83,47.01 arc12 118.68,47 arc3 94.89,44.01 62.39,39.18 45.42,36.66
Copper layers (1+2*15+16): Top 0.035mm / dielectric 0.2mm / Route2 0.0175mm / dielectric 1.065mm / Route15 0.0175mm / dielectric 0.2mm / Bottom 0.035mm
Design rules "HyTech Default (4 Layer)": minimum track width 6mil, minimum drill 10mil, track to track 6mil, track to pad 6mil, pad to pad 6mil, via to via 20mil, smd to smd 6mil, copper to edge 20mil, drill to drill 21mil, minimum pad ring 8mil, minimum via ring 8mil, stop-mask expansion 3mil, vias tented up to drill 30mil, thermal gap 10mil
Holes 3.3 mm at 10.63,26.81 242.79,5 4.78,5 236.94,26.81

### Footprints (pad centres in the part's own frame; a part is rotated, then mirrored left to right if it is on the bottom)
0603-LED = smd 0.8 x 0.8: 1 -0.825,0; 2 0.825,0
TEENSY_SHORT_SSM = smd 1.905 x 1.02: 3.3V -5.842,-11.43; AGND/GND -9.398,-13.97; D0 5.842,-13.97; D1 9.398,-11.43; D2 5.842,-8.89; D3 9.398,-6.35; D4 5.842,-3.81; D5 9.398,-1.27; D6 5.842,1.27; D7 9.398,3.81; D8 5.842,6.35; D9 9.398,8.89; D10 5.842,11.43; D11 9.398,13.97; D12 5.842,16.51; D13 -9.398,16.51; D14 -5.842,13.97; D15 -9.398,11.43; D16 -5.842,8.89; D17 -9.398,6.35; D18 -5.842,3.81; D19 -9.398,1.27; D20 -5.842,-1.27; D21 -9.398,-3.81; D22 -5.842,-6.35; D23 -9.398,-8.89; GND 9.398,-16.51; VIN -5.842,-16.51
OKI-78SR = drill 0.991: 1 -2.54,0; 2 0,0; 3 2.54,0
0805-CAP = smd 0.95 x 1.4: 1 -0.925,0; 2 0.925,0
0603-CAP = smd 0.9 x 0.9: 1 -0.75,0; 2 0.75,0
DO-214AA = smd 1.27 x 2.1: 1 -1.98,0; 2 1.98,0
DSM7T = smd 1.5 x 2: 1 -5.08,-9.5; 2 -2.54,-9.5; 3 0,-9.5; 4 2.54,-9.5; 5 5.08,-9.5; 6 5.08,9.5; 7 2.54,9.5; 8 0,9.5; 9 -2.54,9.5; 10 -5.08,9.5
MOLEX_MICROFIT_SMD_RIGHTANGLE_08_DUAL = smd 1.27 x 2.921: 1 4.5,5.474; 2 1.5,5.474; 3 -1.5,5.474; 4 -4.5,5.474; 5 4.5,10.097; 6 1.5,10.097; 7 -1.5,10.097; 8 -4.5,10.097 | smd 3.429 x 1.651: PAD1 8.386,0; PAD2 -8.386,0
MOLEX_MICROFIT_SMD_RIGHTANGLE_04_DUAL = smd 1.27 x 2.921: 1 1.5,5.474; 2 -1.5,5.474; 3 1.5,10.097; 4 -1.5,10.097 | smd 3.429 x 1.651: PAD1 5.386,0; PAD2 -5.386,0
MOLEX_MICROFIT_SMD_RIGHTANGLE_06_DUAL = smd 1.27 x 2.921: 1 3,5.474; 2 0,5.474; 3 -3,5.474; 4 3,10.097; 5 0,10.097; 6 -3,10.097 | smd 3.429 x 1.651: PAD1 6.886,0; PAD2 -6.886,0
0603-RES = smd 0.9 x 0.8: 1 -0.85,0; 2 0.85,0
CPT-3011C-120 = drill 2.5: F 14.162,8.051; G -14.162,8.051; M 0,-16.29
1206-RES-ARRAY = smd 0.45 x 0.9: 1 -1.2,-0.9; 2 -0.4,-0.9; 3 0.4,-0.9; 4 1.2,-0.9; 5 1.2,0.9; 6 0.4,0.9; 7 -0.4,0.9; 8 -1.2,0.9
5015 = smd 3.429 x 1.778: 1 0,0
NEOPIXEL = smd 1.5 x 1.2: 1 -2.35,1.6; 2 -2.35,-1.6; 3 2.35,-1.6; 4 2.35,1.6
SSOP-20 = smd 0.45 x 1.37: 1 -2.925,-3.6; 2 -2.275,-3.6; 3 -1.625,-3.6; 4 -0.975,-3.6; 5 -0.325,-3.6; 6 0.325,-3.6; 7 0.975,-3.6; 8 1.625,-3.6; 9 2.275,-3.6; 10 2.925,-3.6; 11 2.925,3.6; 12 2.275,3.6; 13 1.625,3.6; 14 0.975,3.6; 15 0.325,3.6; 16 -0.325,3.6; 17 -0.975,3.6; 18 -1.625,3.6; 19 -2.275,3.6; 20 -2.925,3.6
SOIC-08(NARROW,0.15") = smd 0.762 x 1.143: 1 -1.905,-2.603; 2 -0.635,-2.603; 3 0.635,-2.603; 4 1.905,-2.603; 5 1.905,2.603; 6 0.635,2.603; 7 -0.635,2.603; 8 -1.905,2.603
MOUNTING_M3 = hole 3.4: 0,0
3588 = smd 1.575 x 2.819: 1 -4.953,3.035; 2 -4.953,-3.035; 3 4.953,-3.035; 4 4.953,3.035

### Placement (x,y rotation side)
3.3V  152.86,9.61 90 top
5V  152.86,15.96 90 top
12V  152.86,22.31 90 top
24V  152.86,28.66 90 top
A2  123.65,24.85 180 top
A3  174.45,7.07 180 top
A4  187.15,28.66 180 top
C8  185.88,19.77 270 top
C10  100.79,10.88 270 top
C11  98.25,10.88 270 top
C12  23.32,21.04 270 top
C15  97.99,26.12 270 top
C16  20.78,21.04 270 top
C17  101.17,30.57 180 top
C24  176.99,13.42 90 top
C25  94.44,35.01 0 top
C33  173.18,13.42 90 top
C34  98.25,37.55 0 top
C38  105.87,40.09 270 top
C39  103.33,40.09 270 top
C40  182.07,19.77 270 top
D1  136.35,36.28 180 top
D3  211.28,7.07 90 top
D4  198.58,7.07 90 top
D5  204.93,7.07 90 top
D6  192.1,19.14 0 top
D101  22.05,15.96 0 bottom
J2  207.47,28.66 180 top
J3  43.64,28.66 180 top
J4  169.37,33.74 180 top
J6  77.93,35.01 180 top
JP1  98.25,32.47 180 top
LS100  123.65,17.23 180 bottom
R1  151.71,6.56 0 top
R2  151.59,19.39 0 top
R3  193.5,9.61 180 top
R4  193.5,14.69 180 top
R5  193.5,12.15 180 top
R6  136.35,38.82 0 top
R8  182.07,9.61 180 top
R9  95.71,24.85 270 top
R10  151.59,12.91 0 top
R11  109.68,27.39 180 top
R12  182.07,14.69 180 top
R13  109.68,22.31 180 top
R14  182.07,12.15 180 top
R36  94.31,32.47 0 top
R60  98.25,35.01 0 top
R83  151.71,25.49 0 top
RN2  95.71,19.77 90 top
RN4  95.71,14.69 90 top
TP2  227.79,14.69 0 top
TP3  227.79,21.04 0 top
TP4  227.79,8.34 0 top
TP_3.3V  156.67,10.88 0 top
TP_5V  156.67,17.23 0 top
TP_12V  156.67,23.58 0 top
TP_24V  156.67,29.93 0 top
TP_GND  156.67,4.53 0 top
U1  38.56,27.39 90 bottom
U2  38.56,17.23 90 bottom
U3  103.33,17.23 90 top
U4  38.56,7.07 90 bottom
U5  103.33,24.85 270 top
U6  222.71,24.85 90 bottom
U7  212.55,18.5 90 bottom
U8  202.39,12.15 90 bottom
U9  192.23,5.8 90 bottom
U10  155.4,32.47 90 bottom
U11  155.4,19.77 90 bottom
U12  155.4,7.07 90 bottom
U13  91.9,32.47 90 bottom
U14  91.9,19.77 90 bottom
U15  91.9,7.07 90 bottom
U27  104.6,35.01 90 top
U$5  [LOGO_GT_LARGE]  226.52,10.88 0 bottom
U$6  [LOGO_HYTECH_MEDIUM]  137.62,37.55 0 bottom
U$7  [LOGO_HYTECH_SQUARE_EXTRA_LARGE]  18.24,8.34 0 top
U$8  [MOUNTING_M3]  242.77,4.91 0 top
U$9  [MOUNTING_M3]  10.62,26.76 0 top
U$10  [MOUNTING_M3]  236.93,26.76 0 top
U$11  [MOUNTING_M3]  4.77,5.04 0 top
XF1  145.24,33.74 270 top

### Tracks (layer width: path | path; a pad name or v marks a point on that pad's centre or on a via)
24VIN
  Top 0.508: J3.1 42.14,28.43 48.72,35.01 67.77,35.01 71.58,38.82 98.5,38.82 102.69,43.01 137.88,43.01 XF1.2 XF1.1 149.41,37.55 174.45,37.55 176.22,35.77 191.46,35.77 194.08,33.16 D6.2 198.91,19.14 J2.1
+3V3
  Top 0.254: TP_3.3V.1 153.3,10.88 3.3V.2 140.6,10.44 139.39,11.64 135.84,11.64 133.81,9.61 128.73,9.61 126.44,11.9 126.44,33.87 | U27.5 102.06,36.98 102.06,39.37 | 102.06,39.37 102.78,40.09 120.98,40.09 126.44,34.63 126.44,33.87 | C34.2 100.24,37.55 102.06,39.37 | A2.3.3V 128.85,36.28 126.44,33.87
+5V  (via drill 0.35, 0.76)
  Top 0.254: C16.1 20.78,22.68 21.16,23.06 v22.05,23.06 22.93,23.06 23.32,22.68 C12.1 | U3.6 104.92,17.56 v104.6,17.23 | C11.1 C10.1 101.55,12.39 v101.55,13.93 101.17,14.31 U3.20 | 5V.2 153.3,17.23 TP_5V.1 156.67,18.5 v155.4,19.77 | A3.3 171.91,11.4 C33.1 | C39.2 103.33,38.69 103.71,38.31 104.45,38.31 | v109.55,35.52 109.42,35.65 U27.3 107.12,35.65 104.45,38.31 | C38.2 105.87,38.57 105.61,38.31 104.45,38.31
  Top 0.508: A2.VIN v136.35,41.36
  Bottom 0.254: D101.8 v22.05,23.06 | D101.3 v22.05,8.34 | U2.1 42.3,14.88 v42.37,14.82 | v38.56,7.07 38.56,6.32 U4.1 | U1.1 40.35,24.85 v43.64,24.85 | U7.1 213.78,16.52 v213.78,17.73 | U6.1 223.98,22.83 v223.98,24.85 | U8.1 203.66,10.13 v203.66,12.15 | U9.1 193.5,3.78 v193.5,5.8 | U10.1 156.47,30.65 v156.47,32.27 | U11.1 157,18.17 v155.4,19.77 | U12.1 156.16,5.55 v156.16,7.07 | U14.1 92.27,17.42 v91.9,17.79 | U13.1 93.93,29.69 v93.93,28.66 | U15.1 93.17,5.05 v93.17,7.07
  pour Route15: -3.35,-3.09 -3.35,41.36 81.74,71.84 173.18,71.84 251.92,45.17 251.92,-3.09
+12V  (via drill 0.35, 0.76)
  Top 0.508: A4.3 182.07,26.12 C40.1 180.7,20.7 v180.03,20.02 | v127.46,23.58 128.57,22.46 150.85,22.46 151.53,23.14 12V.2 153.3,23.58 TP_12V.1 159.46,20.79 v159.46,19.9 | v103.33,24.85 102.69,25.49 U5.2 98.11,25.49 C15.2
  Bottom 0.508: v127.46,23.58 126.19,24.85 v103.33,24.85 | v159.46,19.9 159.97,19.39 179.4,19.39 v180.03,20.02
+24V
  Top 0.508: 24V.2 152.03,28.66 148.4,28.66 XF1.4 XF1.3 | 24V.2 153.3,29.93 TP_24V.1 | A4.1 189.69,24.51 C8.1 185.53,20.7 184.61,19.77 184.61,17.63 183.13,16.15 180.8,16.15 180.64,16.15 | A3.1 C24.1 180.64,16.15 | 24V.2 153.68,28.66 160.5,28.66 161.77,27.39 161.77,21.02 163.02,19.77 175.72,19.77 179.33,16.15 180.64,16.15
A  (via drill 0.35)
  Top 0.254: v70.56,20.79 70.74,20.97 RN2.5
  Bottom 0.254: D101.7 19.51,23.58 24.97,18.12 67.89,18.12 v70.56,20.79
A2
  Top 0.254: U3.12 98.98,19.51 97.51,20.97 RN2.4
B  (via drill 0.35)
  Top 0.254: RN2.6 71.21,20.17 v70.56,19.52
  Bottom 0.254: D101.6 16.97,22.95 22.35,17.56 68.6,17.56 v70.56,19.52
B2
  Top 0.254: U3.13 99.05,18.86 97.74,20.17 RN2.3
BOTS
  Top 0.254: D4.2 198.58,14.13 199.14,14.69 | R4.1 199.14,14.69 | 199.14,14.69 202.97,18.52 | J2.5 204.16,19.76 204.16,27.14 208.23,31.2 223.98,31.2 230.33,24.85 230.33,22.31 229.06,21.04 TP3.1
  Top 0.508: 202.97,18.52 J2.5
BOTS_READ  (via drill 0.35)
  Top 0.254: R12.1 v184.61,14.69 R4.2 | A2.D16 v136.35,15.96
  Bottom 0.254: v136.35,15.96 169.37,15.96 170.61,14.72 184.58,14.72 v184.61,14.69
BRB
  Top 0.254: R5.1 196.29,10.21 196.29,8.95 197.41,7.83 203.71,7.83 D5.2 | TP4.1 230.33,8.34 231.6,9.61 231.6,15.96 230.33,17.23 221.44,17.23 218.9,19.77 218.9,24.85 216.36,27.39 207.47,27.39 205.97,25.89 J2.2 205.72,22.95 205.56,22.95 204.92,22.31 D5.2
  Top 0.508: D5.2
BRB_READ  (via drill 0.35)
  Top 0.254: R14.1 v184.61,12.15 R5.2 | A2.D17 v136.35,18.5
  Bottom 0.254: v136.35,18.5 142.9,18.5 145.29,20.89 183.34,20.89 184.61,19.62 184.61,15.69 185.31,14.98 185.31,14.4 184.61,13.69 v184.61,12.15
BTN_DIM_READ  (via drill 0.35)
  Top 0.254: A2.D18 v136.35,21.04 | J4.5 167.33,21.61 164.98,21.61 v163.02,23.58
  Bottom 0.254: v163.02,23.58 161.75,24.85 148.99,24.85 146.04,21.9 137.21,21.9 v136.35,21.04
BTN_MC_CYCLE_READ  (via drill 0.35)
  Top 0.254: A2.D20 v136.35,26.12 | J4.3 170.22,26.12 v163.02,26.12
  Bottom 0.254: v136.35,26.12 v163.02,26.12
BTN_MODE_READ  (via drill 0.35)
  Top 0.254: A2.D21 v136.35,28.66 | v167.71,28.66 168.97,28.66 J4.2
  Bottom 0.254: v167.71,28.66 160.09,36.28 143.97,36.28 v136.35,28.66
BTN_PRESET_READ  (via drill 0.35)
  Top 0.254: A2.D19 v136.35,23.58 | v163.02,24.85 165.16,24.85 J4.4
  Bottom 0.254: v136.35,23.58 145.87,23.58 147.9,25.61 162.25,25.61 v163.02,24.85
BTN_START_READ  (via drill 0.35)
  Top 0.254: A2.D22 v136.35,31.2 | v166.83,31.2 166.83,28.73 J4.1
  Bottom 0.254: v136.35,31.2 142.7,37.55 161.75,37.55 166.83,32.47 v166.83,31.2
BUZZER_CTRL
  Top 0.254: 108.37,28.69 109.61,29.93 112.98,29.93 A2.D3 | 108.37,28.69 106.44,26.76 U5.8 | 108.37,28.69 108.37,27.84 R11.2
C  (via drill 0.35)
  Top 0.254: RN2.7 71.68,19.37 v70.56,18.25
  Bottom 0.254: v70.56,18.25 69.42,17.1 26.62,17.1 19.51,9.99 D101.4
C2
  Top 0.254: RN2.2 97.5,19.37 98.67,18.21 U3.14
CANH  (via drill 0.35)
  Top 0.254: JP1.1 99.1,32.6 v100.07,33.57 100.87,34.38 U27.7 102.17,34.38 v103.2,35.4 | J3.4 46.34,19.77 52.53,19.77 v60.15,27.39 | J2.4 211.97,24.67 v211.28,25.36
  Bottom 0.254: v60.15,27.39 69.12,36.36 97.27,36.36 v100.07,33.57 | v211.28,25.36 201.63,35.01 170.64,35.01 165.3,40.35 108.14,40.35 v103.2,35.4
CANL  (via drill 0.35)
  Top 0.254: R60.2 99.73,35.65 v100.28,35.65 U27.6 102.44,35.65 102.9,36.11 105.06,36.11 v105.36,36.41 | J3.3 44.61,21.04 52.53,21.04 v60.15,28.66 | J2.3 208.74,23.42 v208.74,25.36
  Bottom 0.254: v60.15,28.66 68.27,36.79 99.13,36.79 v100.28,35.65 | v208.74,25.36 208.74,27.33 201.46,34.61 170.47,34.61 165.13,39.94 108.91,39.94 105.38,36.41 v105.36,36.41
CIPO
  Top 0.254: U3.3 107.74,15.61 111.2,12.15 115.26,12.15 117.8,9.61 A2.D12
CLK
  Top 0.254: U3.1 107.69,14.31 115.05,6.94 131.65,6.94 A2.D13
COPI
  Top 0.254: A2.D11 111.83,10.88 107.76,14.96 U3.2
CRX
  Top 0.254: U27.4 111.58,36.92 113.49,38.82 A2.D0
CS_CAN
  Top 0.254: U3.7 107.68,18.21 112.47,13.42 A2.D10
CTX
  Top 0.254: U27.1 111.07,33.11 A2.D1
D  (via drill 0.35)
  Top 0.254: RN2.8 72.15,18.57 v70.56,16.98
  Bottom 0.254: v70.56,16.98 70.18,16.6 31.82,16.6 24.59,9.36 D101.2
D2
  Top 0.254: RN2.1 97.41,18.57 98.5,17.49 99.65,17.49 U3.15
DIAL_AUTOCROSS  (via drill 0.35)
  Top 0.254: A2.D6 v112.22,23.58 | v77.93,21.68 74.93,24.68 J6.4
  Bottom 0.254: v112.22,23.58 105.87,23.58 102.08,19.8 79.81,19.8 v77.93,21.68
DIAL_ENDURANCE  (via drill 0.35)
  Top 0.254: A2.D7 v112.22,21.04 | J6.3 78.78,27.39 77.29,27.39 76.27,26.38 v76.27,25.49
  Bottom 0.254: v112.22,21.04 110.56,19.39 78.69,19.39 76.27,21.8 v76.27,25.49
DIAL_LAUNCH  (via drill 0.35)
  Top 0.254: A2.D4 v112.22,28.66 | v83.01,23.58 81.67,24.91 J6.6
  Bottom 0.254: v112.22,28.66 110.08,26.53 102.25,26.53 96.68,20.96 85.62,20.96 v83.01,23.58
DIAL_MODE_1  (via drill 0.35)
  Top 0.254: A2.D8 v112.22,18.5 | v72.85,25.49 72.85,26.12 74.12,27.39 75.78,27.39 J6.2
  Bottom 0.254: v72.85,25.49 72.85,24.22 78.15,18.91 111.81,18.91 v112.22,18.5
DIAL_MODE_2  (via drill 0.35)
  Top 0.254: A2.D9 v112.22,15.96 | v71.58,25.49 71.58,26.19 J6.1
  Bottom 0.254: v112.22,15.96 99.52,15.96 96.98,18.5 77.29,18.5 71.58,24.22 v71.58,25.49
DIAL_SKIDPAD  (via drill 0.35)
  Top 0.254: A2.D5 v112.22,26.12 | v79.2,23.58 77.93,24.85 J6.5
  Bottom 0.254: v79.2,23.58 79.2,21.04 79.68,20.56 96.85,20.56 102.42,26.12 v112.22,26.12
E  (via drill 0.35)
  Top 0.254: RN4.6 70.58,15.09 v70.56,15.07
  Bottom 0.254: D101.1 27.13,10.63 32.59,16.09 69.54,16.09 v70.56,15.07
E2
  Top 0.254: U3.16 98.94,16.91 97.12,15.09 RN4.3
F  (via drill 0.35)
  Top 0.254: RN4.7 69.54,14.29 v60.15,23.69
  Bottom 0.254: v60.15,23.69 56.44,27.39 26.52,27.39 D101.9
F2
  Top 0.254: U3.17 99.68,16.21 99.01,16.21 97.08,14.29 RN4.2
FEED
  Top 0.254: R13.2 108.15,21.63 102.04,21.63 U5.4 98.88,22.95 95.71,26.12 | C17.2 96.34,30.57 95.71,29.93 95.71,26.12 | 95.71,26.12 R9.1
G  (via drill 0.35)
  Top 0.254: RN4.8 68.97,13.49 v60.15,22.31
  Bottom 0.254: v60.15,22.31 55.7,26.76 28.42,26.76 D101.10
G2
  Top 0.254: U3.18 99.03,15.61 96.92,13.49 RN4.1
GND  (via drill 0.35, 0.76)
  Top 0.254: C16.2 20.78,19.53 21.28,19.02 v22.05,19.02 22.93,19.02 23.32,19.4 C12.2 | C11.2 98.25,9.37 98.75,8.86 v99.52,8.86 100.15,8.86 100.79,9.5 C10.2 | U3.5 U3.4 105.91,16.26 v104.6,14.94 | v104.47,20.15 105.11,19.51 U3.9 | U5.5 v103.33,22.95 | U27.2 v105.48,34.38 | TP_GND.1 155.4,3.26 v154.13,3.26 | C33.2 v173.18,15.96 | R12.2 179.56,13.04 v179.53,13.04 | R14.2 v179.53,12.15 | R8.2 v179.53,9.61 | A2.AGND/GND R6.1 | v112.22,27.39 R11.1 | C38.1 105.87,41.62 105.36,42.12 v104.6,42.12 103.83,42.12 103.33,41.62 C39.1 | C34.1 v95.71,37.55 | v93.55,37.68 93.55,35.15 C25.1 | R10.1 150.74,11.81 v150.32,11.39 | v150.32,5.04 150.7,5.42 150.86,5.59 R1.1 | U27.8 102.69,33.11 v103.96,34.38
  Top 0.508: R83.1 150.86,24.13 v150.32,23.58 | R2.1 150.74,17.65 v150.32,17.23 | C40.2 181.05,17.83 v179.78,17.83 | C8.2 v185.88,16.47 | C24.2 v176.99,15.96 | J3.2 45.14,25.46 v45.16,25.49 | J2.8 215.02,18.56 v215.09,18.5 | A2.AGND/GND 128.73,38.82 v126.19,36.28 | D6.1 187.91,16.93 v187.91,16.47 | J4.6 172.43,23.58 v174.45,23.58 | D3.1 210.01,3.82 v210.01,3.26 | D5.1 204.93,4.53 v203.66,3.26 | D4.1 197.31,3.82 v197.31,3.26 | A2.GND v109.68,41.36 | v98.25,28.66 97.99,28.41 C15.1
  Bottom 0.254: U4.3 34.94,9.42 v34.75,9.61 | U2.3 34.94,19.58 v34.75,19.77 | U1.3 34.94,29.74 v34.75,29.93 | U7.3 210.95,19.19 v210.64,18.88 | U6.3 221.44,26.87 v221.44,24.85 | U8.3 201.12,14.17 v201.12,12.15 | U9.3 190.96,7.82 v190.96,5.8 | U10.3 154.13,34.49 v154.13,32.47 | U11.3 154.87,22.12 v155.4,21.6 | U12.3 154.13,9.09 v154.13,7.07 | U14.3 91.45,22.12 v91.9,21.68 | U13.3 90.3,33.31 v90.37,33.23 | U15.3 90.63,9.09 v90.63,7.07
  pour Route2: -3.35,-1.82 -3.35,41.36 81.74,71.84 173.18,71.84 251.92,45.17 251.92,-3.09 -3.35,-3.09
HORNB
  Top 0.254: U5.6 108.62,24.22 R13.1 109.07,20.86 104.18,20.86 103.76,20.44 103.76,14.78 109.36,9.18 LS100.G
HORNS
  Top 0.254: C17.1 103.19,30.57 104.46,29.3 104.46,26.26 105.23,25.49 U5.7 107.77,25.49 108.41,24.85 118.57,24.85 119.84,26.12 119.84,31.2 122.16,33.52 LS100.M
INERTIA
  Top 0.254: 194.69,9.61 197.13,7.17 205.31,7.17 207.19,9.05 D3.2 | D3.2 211.28,13.25 J2.6 | D3.2 222.15,9.05 TP2.1
  Top 0.508: R3.1 194.69,9.61
INERTIA_READ  (via drill 0.35)
  Top 0.254: R8.1 v184.61,9.61 R3.2 | v136.35,14.69 134.31,14.69 A2.D15
  Bottom 0.254: v136.35,14.69 136.98,14.06 179.53,14.06 183.97,9.61 v184.61,9.61
N$1
  Bottom 0.254: U11.4 157.19,22.31 163.02,22.31 164.29,23.58 164.29,26.12 163.4,27.01 156.91,27.01 U10.2
N$3
  Top 0.254: R6.2 137.2,36.31 D1.1
N$4
  Bottom 0.254: U8.2 199.14,8.15 U9.4
N$5
  Bottom 0.254: U1.2 40.16,21.84 U2.4
N$6
  Bottom 0.254: U4.4 36.96,12.62 U2.2
N$7
  Bottom 0.254: U4.2 39.69,1.99 211.28,1.99 222.71,13.42 222.71,25.6 U6.4
N$8
  Bottom 0.254: U6.2 219.46,20.85 U7.4
N$9  (via drill 0.35)
  Top 0.254: v159.71,16.85 160.83,15.73 160.83,10.73 v157.43,7.32
  Bottom 0.254: U11.2 155.25,17.42 156.28,16.39 157.71,16.39 158.17,16.85 v159.71,16.85 | v157.43,7.32 157,7.76 U12.4
N$10
  Top 0.254: R36.2 JP1.2
N$12
  Bottom 0.254: U14.2 93.5,14.22 U15.4
N$20
  Bottom 0.254: U13.2 93.5,26.92 U14.4
N$21
  Top 0.254: R60.1 C25.2 93.46,33.28 R36.1
N$23  (via drill 0.35)
  Top 0.254: v190.12,4.84 170.32,4.84 161.24,13.93 161.24,24.85 161.24,25.99 v159.46,27.77
  Bottom 0.254: U9.2 190.63,4.34 v190.12,4.84 | U10.4 159.46,32.36 v159.46,27.77
N$26
  Bottom 0.254: U7.2 209.3,14.5 U8.4
N$27  (via drill 0.35)
  Top 0.254: v95.71,10.88 95.66,10.93 95.66,21.19 91.9,24.95 v91.9,33.74
  Bottom 0.254: U12.2 152.34,3.26 103.33,3.26 v95.71,10.88 | U13.4 92.61,34.82 91.9,34.11 v91.9,33.74
N$31
  Top 0.254: R1.2 152.56,6.78 152.86,7.07 3.3V.1
N$32
  Top 0.254: R10.2 152.44,13 152.86,13.42 5V.1
N$33
  Top 0.508: 12V.1 152.86,19.81 R2.2
N$38
  Top 0.508: 24V.1 152.86,25.78 R83.2
N$54
  Top 0.254: LS100.F 137.81,8.53 135.08,5.8 108.71,5.8 103.33,11.19 103.33,17.86 97.19,24 R9.2
NEOPIXEL_CTRL  (via drill 0.35)
  Top 0.254: A2.D2 116.66,32.6 v112.09,32.6
  Bottom 0.254: v112.09,32.6 90.88,32.6 84.78,26.5 59.87,26.5 56.63,29.74 U1.4
TEENSY_ON
  Top 0.254: D1.2 135.52,35.01 134.25,33.74 A2.D23

### Text on the board
tPlace: HyTech Racing 2023 / Dashboard rev6 / Designed by Youssef Jaafar
bPlace: LAUNCH | PACK | AMS | TORQUE | GLV | INERTIA | IMD | BOTS | MCU | DRIVE | BRAKE | BRB
tNames: +24V